# EasyEDA Pro project HF-RADIO.eprj

# Schematic radio-teste

## Sheets
1 SSB_GEN
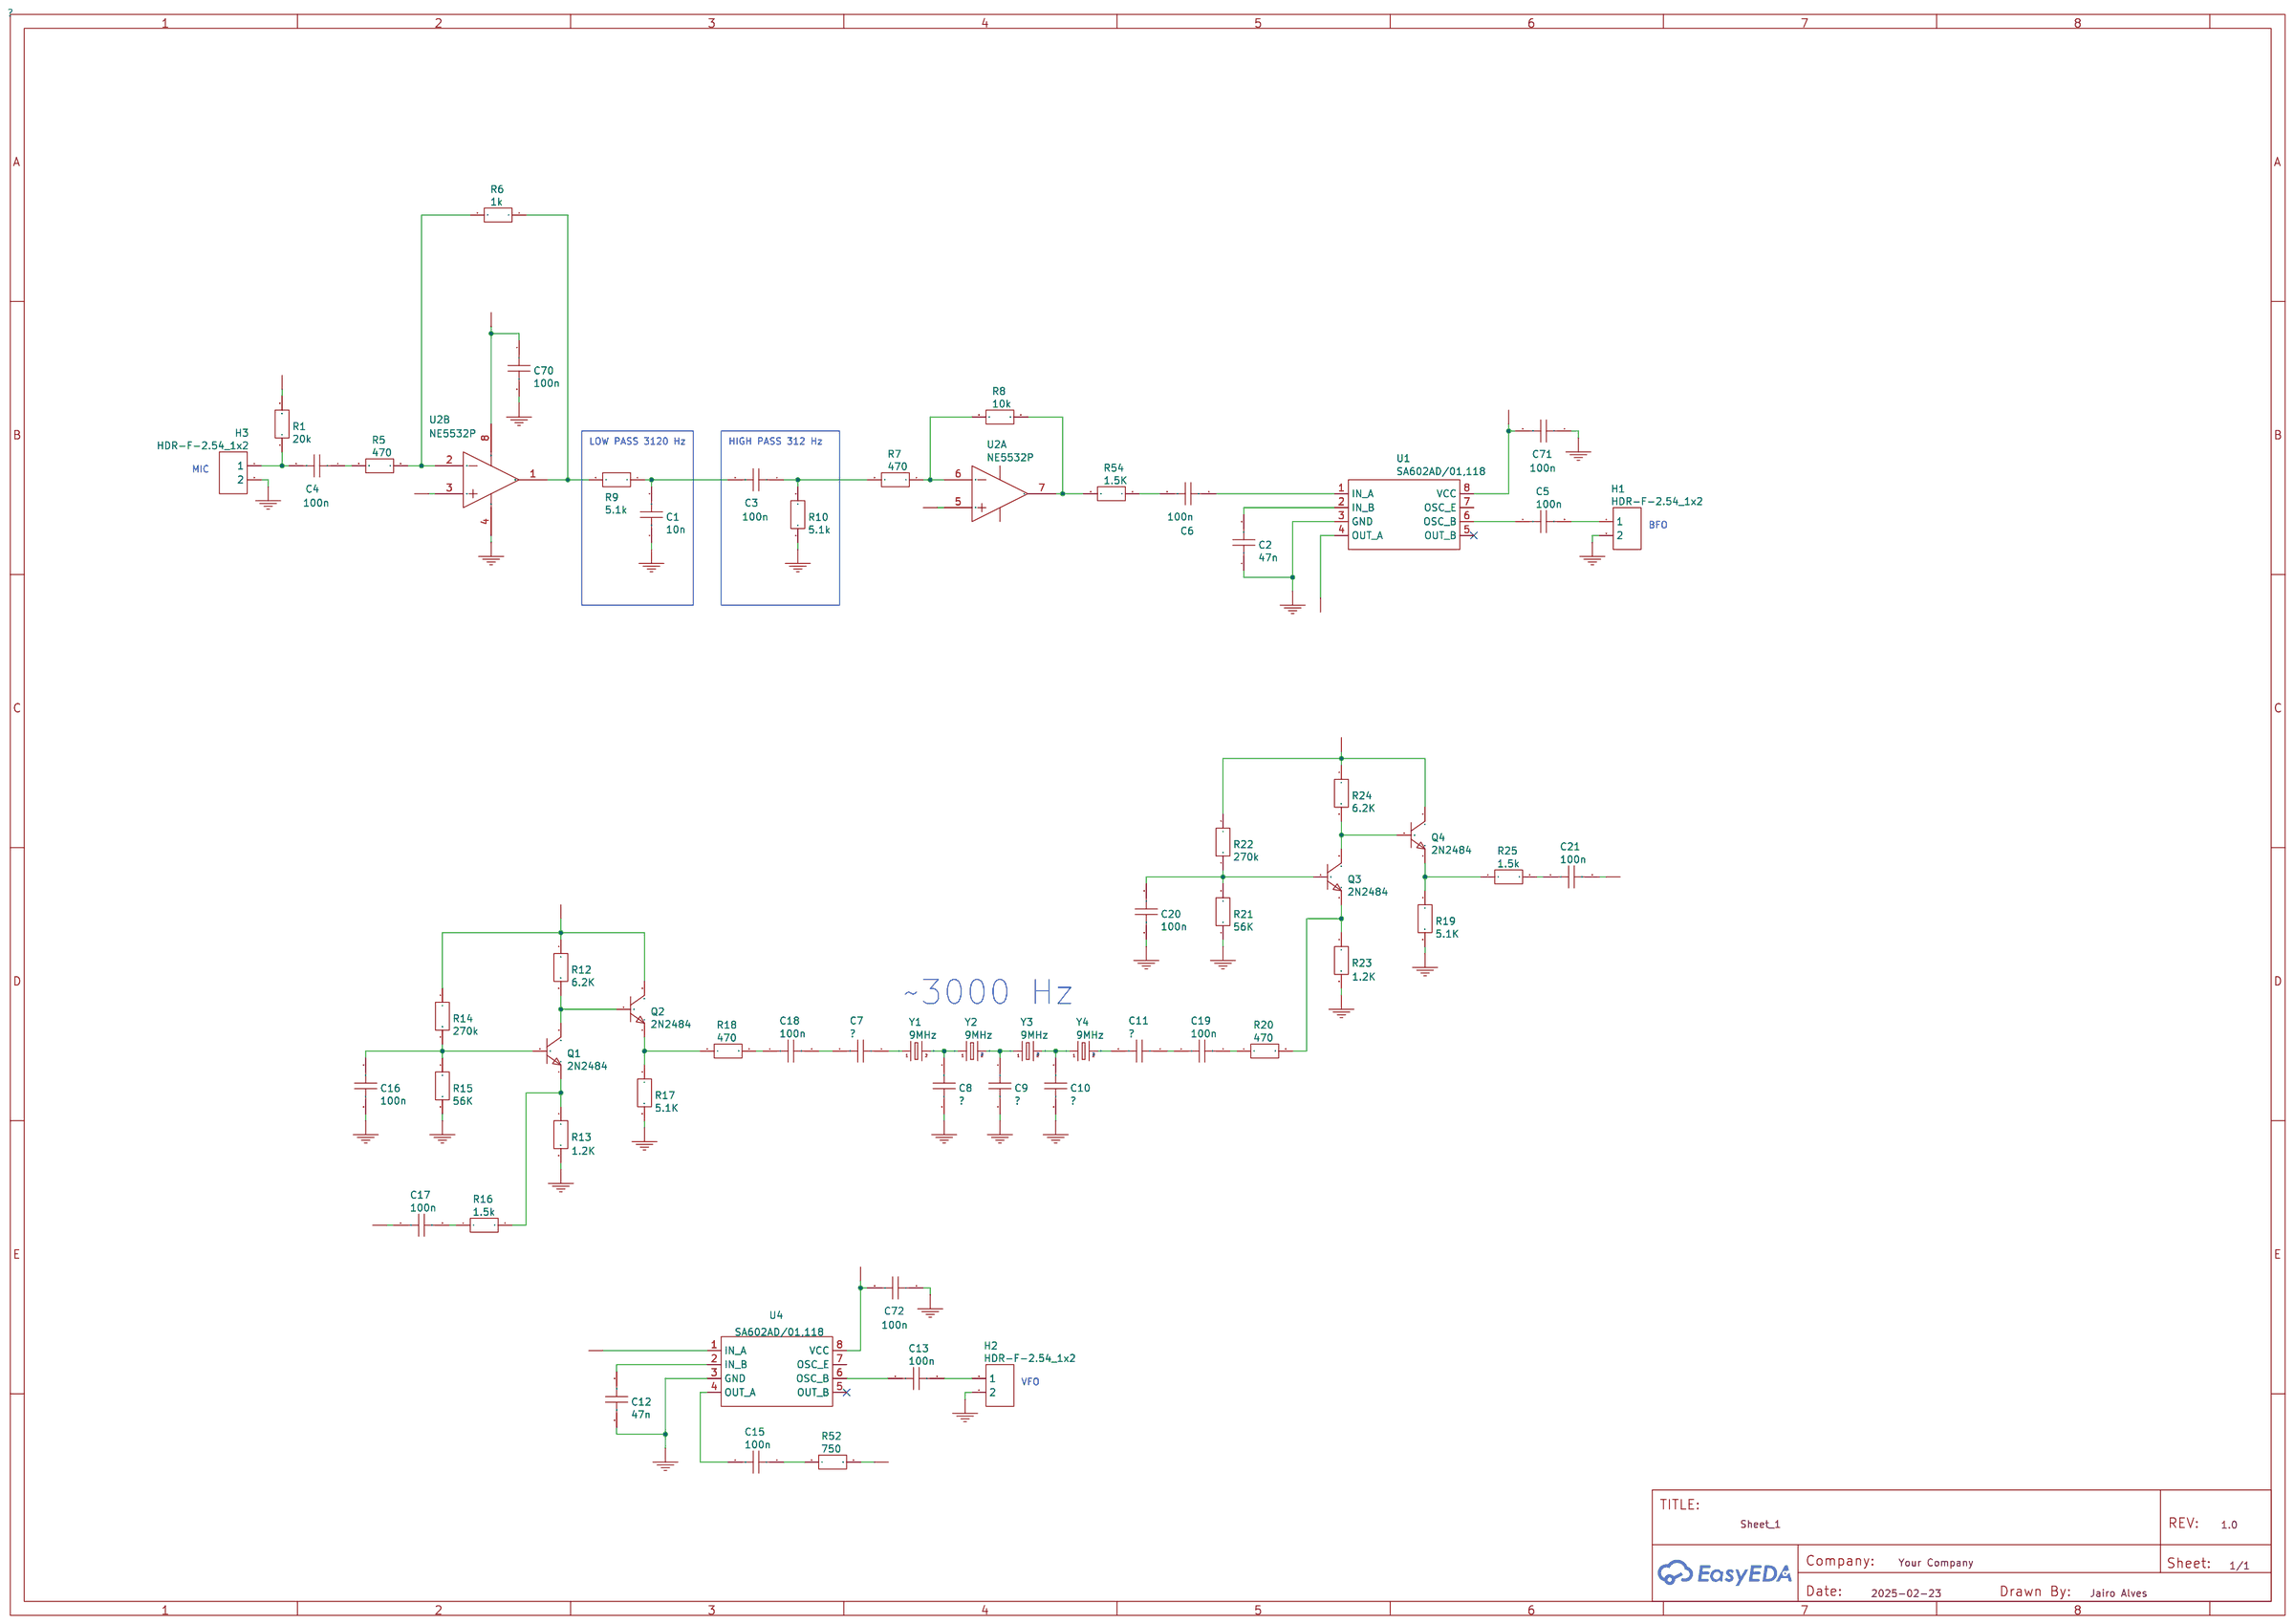
[diagram p0: SSB_GEN]
2 SSB_DEC: Board Name: SSB_MODULATION; Create Date: 2025-04-01; Page Name: SSB_DEC; Project Name: HF-RADIO; Schematic Name: radio-teste; Update Date: 2025-04-01; Add into BOM: yes; Company: Your Company; Convert to PCB: yes; Date: 2025-03-25; Draw By: Jairo Alves; REV: 1.0; Sheet: 1/1; spicePre: .
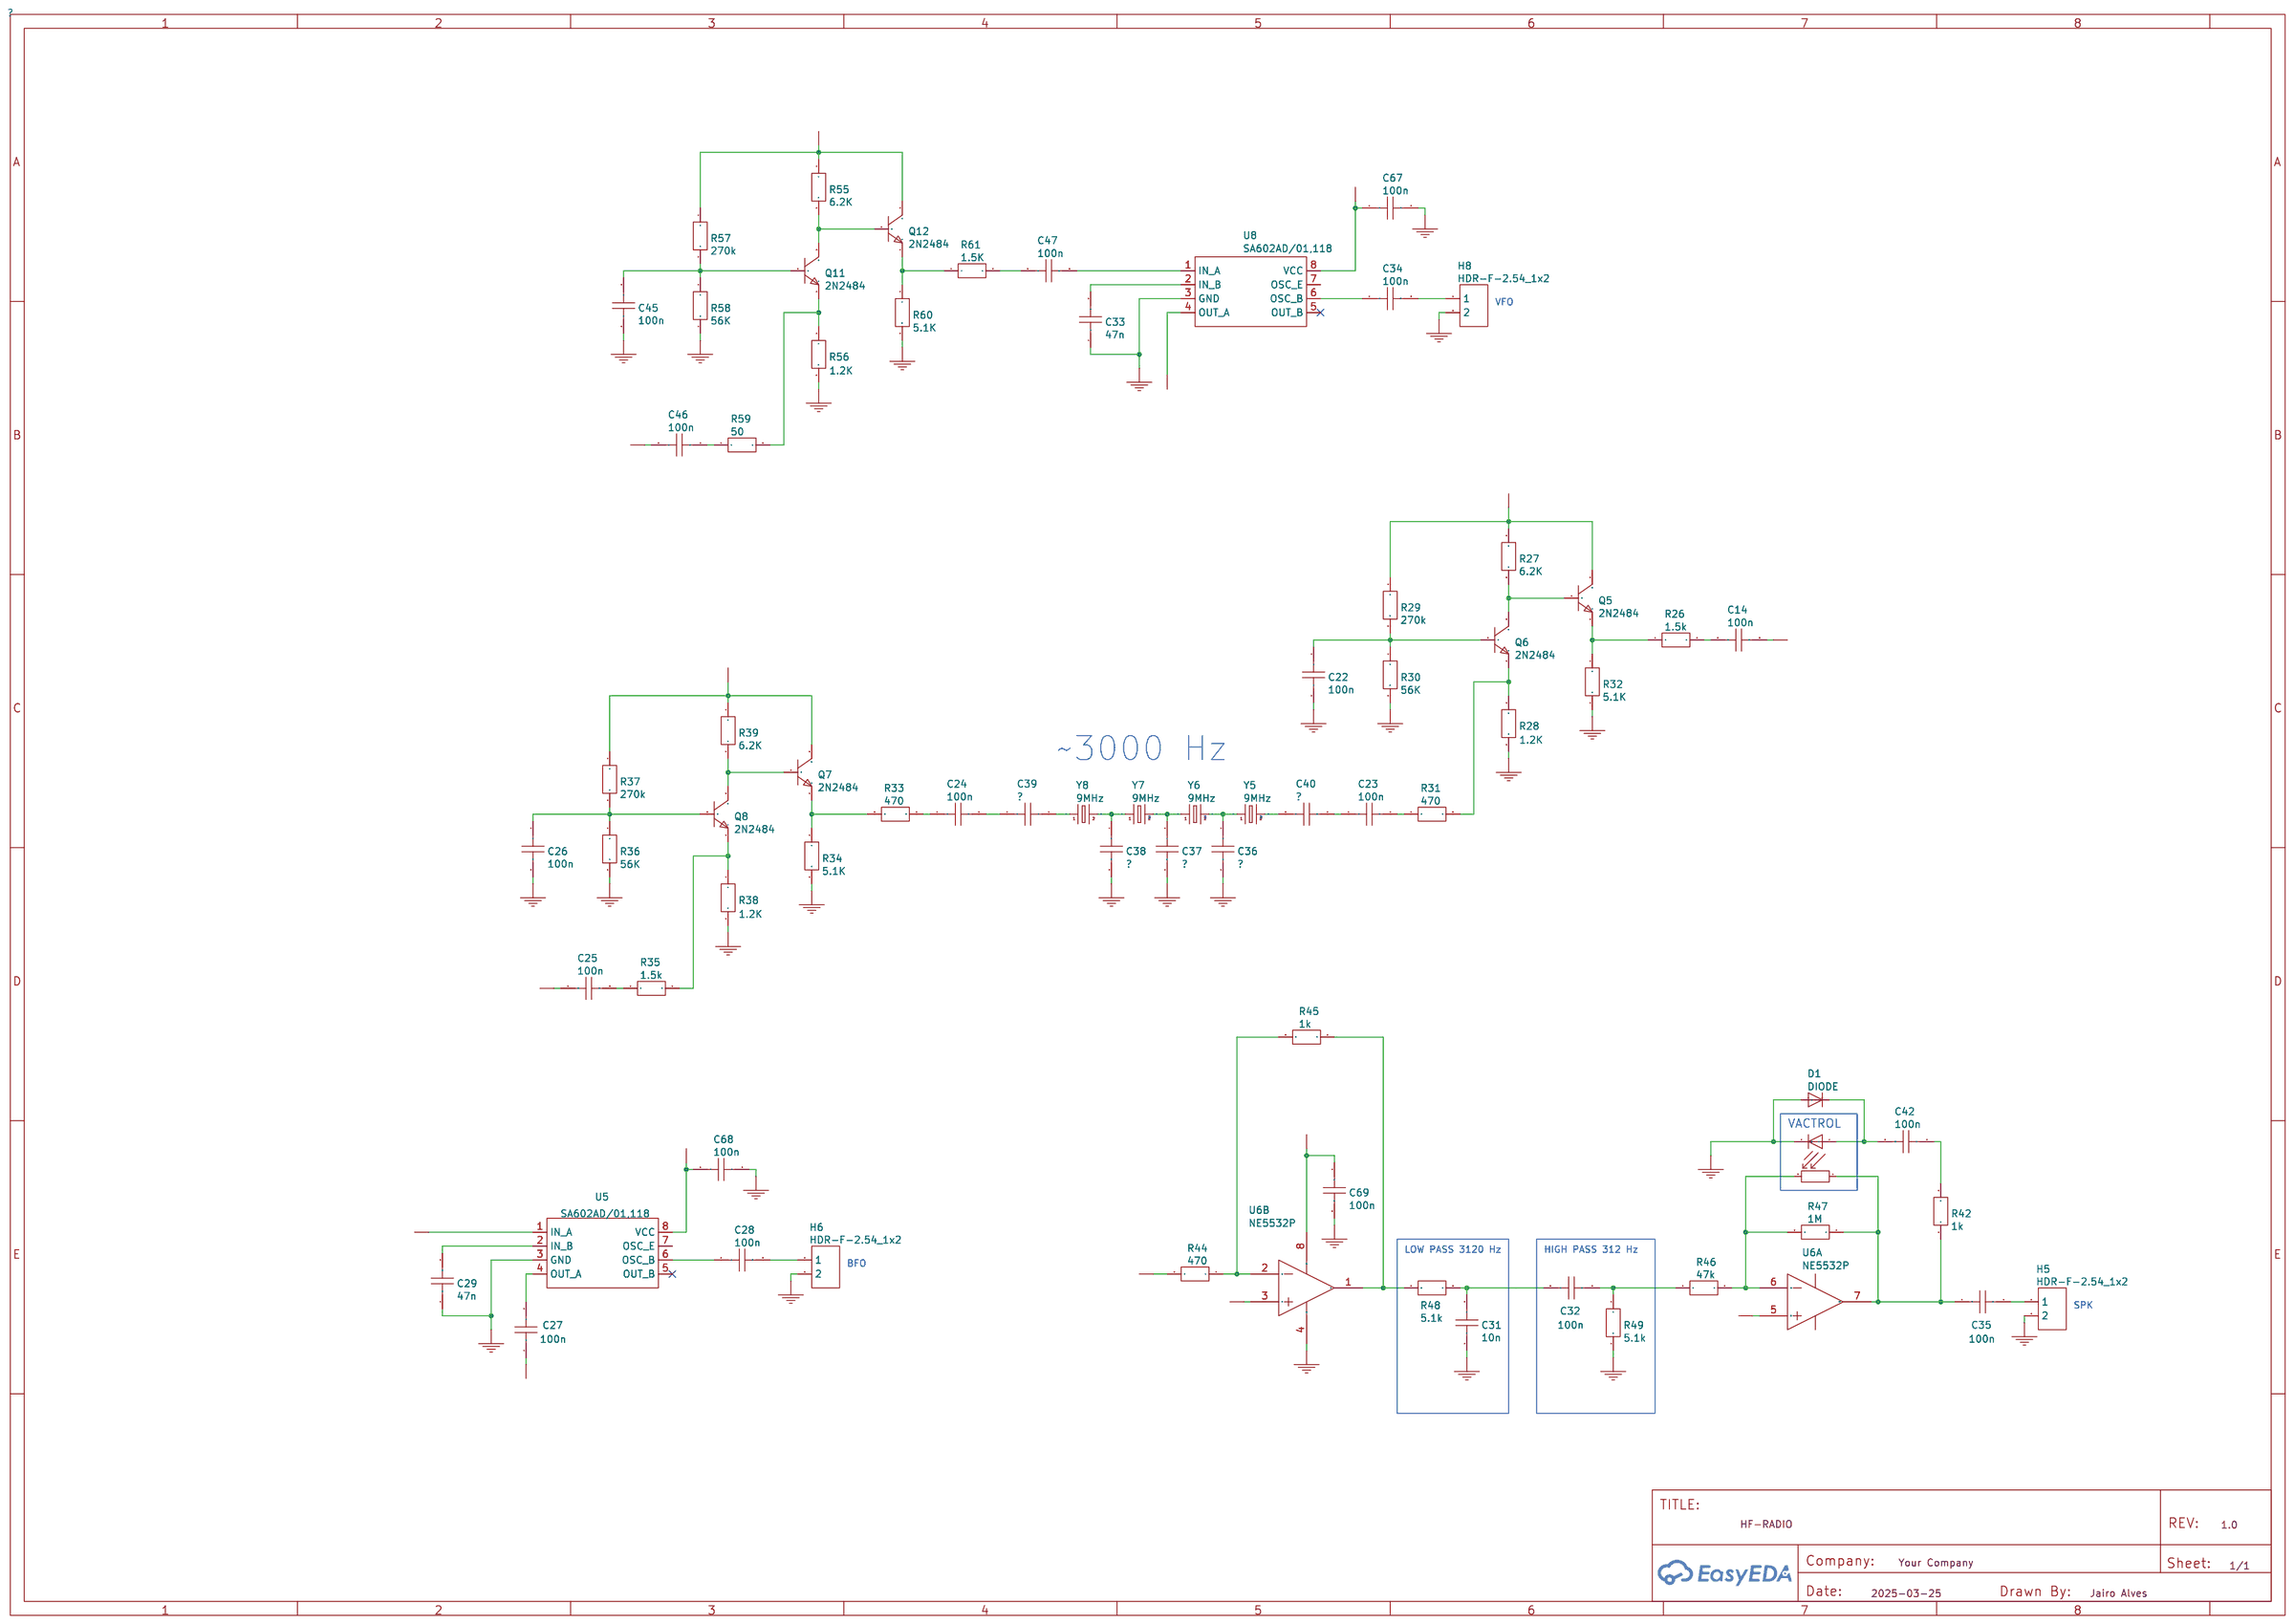
[diagram p1: SSB_DEC]

## Parts
sheet SSB_DEC
C14  100n  [RAD-0.1]
C22  100n  [RAD-0.1]
C23  100n  [RAD-0.1]
C24  100n  [RAD-0.1]
C25  100n  [RAD-0.1]
C26  100n  [RAD-0.1]
C27  100n  [RAD-0.1]
C28  100n  [RAD-0.1]
C29  47n  [RAD-0.1]
C31  10n  [RAD-0.1]
C32  100n  [RAD-0.1]
C33  47n  [RAD-0.1]
C34  100n  [RAD-0.1]
C35  100n  [RAD-0.1]
C36  ?  [RAD-0.1]
C37  ?  [RAD-0.1]
C38  ?  [RAD-0.1]
C39  ?  [RAD-0.1]
C40  ?  [RAD-0.1]
C42  100n  [RAD-0.1]
C45  100n  [RAD-0.1]
C46  100n  [RAD-0.1]
C47  100n  [RAD-0.1]
C67  100n  [RAD-0.1]
C68  100n  [RAD-0.1]
C69  100n  [RAD-0.1]
D1  DIODE
H5  HDR-F-2.54_1x2  [HDR-F-2.54_1X2]
H6  HDR-F-2.54_1x2  [HDR-F-2.54_1X2]
H8  HDR-F-2.54_1x2  [HDR-F-2.54_1X2]
LED1  LED5MM
Q5  2N2484
Q6  2N2484
Q7  2N2484
Q8  2N2484
Q11  2N2484
Q12  2N2484
R26  1.5k  [R_AXIAL-0.3]
R27  6.2K  [R_AXIAL-0.3]
R28  1.2K  [R_AXIAL-0.3]
R29  270k  [R_AXIAL-0.3]
R30  56K  [R_AXIAL-0.3]
R31  470  [R_AXIAL-0.3]
R32  5.1K  [R_AXIAL-0.3]
R33  470  [R_AXIAL-0.3]
R34  5.1K  [R_AXIAL-0.3]
R35  1.5k  [R_AXIAL-0.3]
R36  56K  [R_AXIAL-0.3]
R37  270k  [R_AXIAL-0.3]
R38  1.2K  [R_AXIAL-0.3]
R39  6.2K  [R_AXIAL-0.3]
R40  A9050
R42  1k  [R_AXIAL-0.3]
R44  470  [R_AXIAL-0.3]
R45  1k  [R_AXIAL-0.3]
R46  47k  [R_AXIAL-0.3]
R47  1M  [R_AXIAL-0.3]
R48  5.1k  [R_AXIAL-0.3]
R49  5.1k  [R_AXIAL-0.3]
R55  6.2K  [R_AXIAL-0.3]
R56  1.2K  [R_AXIAL-0.3]
R57  270k  [R_AXIAL-0.3]
R58  56K  [R_AXIAL-0.3]
R59  50  [R_AXIAL-0.3]
R60  5.1K  [R_AXIAL-0.3]
R61  1.5K  [R_AXIAL-0.3]
U5  SA602AD/01,118  [SOP-8_L4.9-W3.9-P1.27-LS6.0-BL]
U6  NE5532P  [DIP-8_L9.4-W6.4-P2.54-LS9.1-BL]  (sections 1,2)
U8  SA602AD/01,118  [SOP-8_L4.9-W3.9-P1.27-LS6.0-BL]
Y5  9MHz  [HC49U-V]
Y6  9MHz  [HC49U-V]
Y7  9MHz  [HC49U-V]
Y8  9MHz  [HC49U-V]
sheet SSB_GEN
C1  10n  [RAD-0.1]
C2  47n  [RAD-0.1]
C3  100n  [RAD-0.1]
C4  100n  [RAD-0.1]
C5  100n  [RAD-0.1]
C6  100n  [RAD-0.1]
C7  ?  [RAD-0.1]
C8  ?  [RAD-0.1]
C9  ?  [RAD-0.1]
C10  ?  [RAD-0.1]
C11  ?  [RAD-0.1]
C12  47n  [RAD-0.1]
C13  100n  [RAD-0.1]
C15  100n  [RAD-0.1]
C16  100n  [RAD-0.1]
C17  100n  [RAD-0.1]
C18  100n  [RAD-0.1]
C19  100n  [RAD-0.1]
C20  100n  [RAD-0.1]
C21  100n  [RAD-0.1]
C70  100n  [RAD-0.1]
C71  100n  [RAD-0.1]
C72  100n  [RAD-0.1]
H1  HDR-F-2.54_1x2  [HDR-F-2.54_1X2]
H2  HDR-F-2.54_1x2  [HDR-F-2.54_1X2]
H3  HDR-F-2.54_1x2  [HDR-F-2.54_1X2]
Q1  2N2484
Q2  2N2484
Q3  2N2484
Q4  2N2484
R1  20k  [R_AXIAL-0.3]
R5  470  [R_AXIAL-0.3]
R6  1k  [R_AXIAL-0.3]
R7  470  [R_AXIAL-0.3]
R8  10k  [R_AXIAL-0.3]
R9  5.1k  [R_AXIAL-0.3]
R10  5.1k  [R_AXIAL-0.3]
R12  6.2K  [R_AXIAL-0.3]
R13  1.2K  [R_AXIAL-0.3]
R14  270k  [R_AXIAL-0.3]
R15  56K  [R_AXIAL-0.3]
R16  1.5k  [R_AXIAL-0.3]
R17  5.1K  [R_AXIAL-0.3]
R18  470  [R_AXIAL-0.3]
R19  5.1K  [R_AXIAL-0.3]
R20  470  [R_AXIAL-0.3]
R21  56K  [R_AXIAL-0.3]
R22  270k  [R_AXIAL-0.3]
R23  1.2K  [R_AXIAL-0.3]
R24  6.2K  [R_AXIAL-0.3]
R25  1.5k  [R_AXIAL-0.3]
R52  750  [R_AXIAL-0.3]
R54  1.5K  [R_AXIAL-0.3]
U1  SA602AD/01,118  [SOP-8_L4.9-W3.9-P1.27-LS6.0-BL]
U2  NE5532P  [DIP-8_L9.4-W6.4-P2.54-LS9.1-BL]  (sections 1,2)
U4  SA602AD/01,118  [SOP-8_L4.9-W3.9-P1.27-LS6.0-BL]
Y1  9MHz  [HC49U-V]
Y2  9MHz  [HC49U-V]
Y3  9MHz  [HC49U-V]
Y4  9MHz  [HC49U-V]

## Library data of the parts
C3-C6 C13-C28 C32 C34 C35 C42 C45-C47 C67-C72 = 100n: nameAlias: Value(F); Contributor: LCEDA_Lib; spicePre: C; spiceSymbolName: C_RAD-0.1_US
C2 C12 C29 C33 = 47n: nameAlias: Value(F); Contributor: LCEDA_Lib; spicePre: C; spiceSymbolName: C_RAD-0.1_US
C1 C31 = 10n: nameAlias: Value(F); Contributor: LCEDA_Lib; spicePre: C; spiceSymbolName: C_RAD-0.1_US
C7-C11 C36-C40 = ?: nameAlias: Value(F); Contributor: LCEDA_Lib; spicePre: C; spiceSymbolName: C_RAD-0.1_US
D1 = DIODE: Contributor: Adafruit; spicePre: D
H1-H3 H5 H6 H8 = HDR-F-2.54_1x2: Supplier Part: C49661; Supplier: LCSC; Contributor: LCEDA_Lib; spicePre: H
LED1 = LED5MM: Contributor: Pinoccio; spicePre: L
Q1-Q8 Q11 Q12 = 2N2484: Supplier: LCSC; Supplier Part: C5444770; Manufacturer: MICROCHIP(美国微芯); Contributor: lcsc; spicePre: Q
R16 R25 R26 R35 = 1.5k: nameAlias: Value(Ω); Contributor: LCEDA_Lib; spicePre: R; spiceSymbolName: R_AXIAL-0.3_EU
R12 R24 R27 R39 R55 = 6.2K: nameAlias: Value(Ω); Contributor: LCEDA_Lib; spicePre: R; spiceSymbolName: R_AXIAL-0.3_EU
R13 R23 R28 R38 R56 = 1.2K: nameAlias: Value(Ω); Contributor: LCEDA_Lib; spicePre: R; spiceSymbolName: R_AXIAL-0.3_EU
R14 R22 R29 R37 R57 = 270k: nameAlias: Value(Ω); Contributor: LCEDA_Lib; spicePre: R; spiceSymbolName: R_AXIAL-0.3_EU
R15 R21 R30 R36 R58 = 56K: nameAlias: Value(Ω); Contributor: LCEDA_Lib; spicePre: R; spiceSymbolName: R_AXIAL-0.3_EU
R5 R7 R18 R20 R31 R33 R44 = 470: nameAlias: Value(Ω); Contributor: LCEDA_Lib; spicePre: R; spiceSymbolName: R_AXIAL-0.3_EU
R17 R19 R32 R34 R60 = 5.1K: nameAlias: Value(Ω); Contributor: LCEDA_Lib; spicePre: R; spiceSymbolName: R_AXIAL-0.3_EU
R40 = A9050: license: https://www.gnu.org/licenses/lgpl-2.1.html; Contributor: KiCAD; spicePre: R
R6 R42 R45 = 1k: nameAlias: Value(Ω); Contributor: LCEDA_Lib; spicePre: R; spiceSymbolName: R_AXIAL-0.3_EU
R46 = 47k: nameAlias: Value(Ω); Contributor: LCEDA_Lib; spicePre: R; spiceSymbolName: R_AXIAL-0.3_EU
R47 = 1M: nameAlias: Value(Ω); Contributor: LCEDA_Lib; spicePre: R; spiceSymbolName: R_AXIAL-0.3_EU
R9 R10 R48 R49 = 5.1k: nameAlias: Value(Ω); Contributor: LCEDA_Lib; spicePre: R; spiceSymbolName: R_AXIAL-0.3_EU
R59 = 50: nameAlias: Value(Ω); Contributor: LCEDA_Lib; spicePre: R; spiceSymbolName: R_AXIAL-0.3_EU
R54 R61 = 1.5K: nameAlias: Value(Ω); Contributor: LCEDA_Lib; spicePre: R; spiceSymbolName: R_AXIAL-0.3_EU
U1 U4 U5 U8 = SA602AD/01,118: Supplier: LCSC; Supplier Part: C2654478; Manufacturer: NXP(恩智浦); JLCPCB Part Class: Extended Part; Contributor: LCSC; spicePre: U
U2 U6 = NE5532P: tags: Audio Operational Amplifier; image: http://image.lceda.cn/szlcsc/C5326.jpg; Supplier Part: C5326; Supplier: LCSC; Manufacturer: TI(德州仪器); JLCPCB Part Class: Extended Part; timeStamp: 1460221582; subpart_no: 1; spicePre: U
Y1-Y8 = 9MHz: Contributor: SparkFun; spicePre: Y; spiceSymbolName: CRYSTALHC49UV
R1 = 20k: nameAlias: Value(Ω); Contributor: LCEDA_Lib; spicePre: R; spiceSymbolName: R_AXIAL-0.3_EU
R8 = 10k: nameAlias: Value(Ω); Contributor: LCEDA_Lib; spicePre: R; spiceSymbolName: R_AXIAL-0.3_EU
R52 = 750: nameAlias: Value(Ω); Contributor: LCEDA_Lib; spicePre: R; spiceSymbolName: R_AXIAL-0.3_EU

## Nets
GND: C1.1 C2.1 C8.2 C9.2 C10.2 C12.1 C16.2 C20.2 C22.2 C26.2 C29.1 C31.1 C33.1 C36.2 C37.2 C38.2 C45.2 C67.2 C68.2 C69.2 C70.2 C71.1 C72.1 D1.A H1.2 H2.2 H3.2 H5.2 H6.2 H8.2 LED1.K(C) R10.2 R13.2 R15.2 R17.2 R19.2 R21.2 R23.2 R28.2 R30.2 R32.2 R34.2 R36.2 R38.2 R49.2 R56.2 R58.2 R60.2 U1.3(GND) U2.4(VCC-) U4.3(GND) U5.3(GND) U6.4(VCC-) U8.3(GND)
AUD_FLT: C27.1 R44.2
CFRX_IN: C25.1 U8.4(OUT_A)
CFRX_OUT: C14.2 U5.1(IN_A)
CFTX_IN: C17.1 U1.4(OUT_A)
CFTX_OUT: C21.2 U4.1(IN_A)
SSB_IN: C46.1
SSB_OUT: R52.2
SSBMXR: C67.1 C68.1 C71.2 C72.2 U1.8(VCC) U4.8(VCC) U5.8(VCC) U8.8(VCC)
SSBPWR: C69.1 C70.1 Q2.3(C) Q4.3(C) Q5.3(C) Q7.3(C) Q12.3(C) R1.2 R12.1 R14.1 R22.1 R24.1 R27.1 R29.1 R37.1 R39.1 R55.1 R57.1 U2.8(VCC+) U6.8(VCC+)
VCC/2: U2.3(IN1+) U2.5(IN2+) U6.3(IN1+) U6.5(IN2+)
Net-(C1-2): C1.2 C3.2 R9.1
Net-(C2-2): C2.2 U1.2(IN_B)
Net-(C3-1): C3.1 R7.2 R10.1
Net-(C4-1): C4.1 R5.2
Net-(C4-2): C4.2 H3.1 R1.1
Net-(C5-1): C5.1 U1.6(OSC_B)
Net-(C5-2): C5.2 H1.1
Net-(C6-1): C6.1 U1.1(IN_A)
Net-(C6-2): C6.2 R54.1
Net-(C7-1): C7.1 Y1.1
Net-(C7-2): C7.2 C18.2
Net-(C8-1): C8.1 Y1.2 Y2.1
Net-(C9-1): C9.1 Y2.2 Y3.1
Net-(C10-1): C10.1 Y3.2 Y4.1
Net-(C11-1): C11.1 C19.1
Net-(C11-2): C11.2 Y4.2
Net-(C12-2): C12.2 U4.2(IN_B)
Net-(C13-1): C13.1 U4.6(OSC_B)
Net-(C13-2): C13.2 H2.1
Net-(C14-1): C14.1 R26.2
Net-(C15-1): C15.1 R52.1
Net-(C15-2): C15.2 U4.4(OUT_A)
Net-(C16-1): C16.1 Q1.2(B) R14.2 R15.1
Net-(C17-2): C17.2 R16.1
Net-(C18-1): C18.1 R18.2
Net-(C19-2): C19.2 R20.1
Net-(C20-1): C20.1 Q3.2(B) R21.1 R22.2
Net-(C21-1): C21.1 R25.2
Net-(C22-1): C22.1 Q6.2(B) R29.2 R30.1
Net-(C23-1): C23.1 C40.1
Net-(C23-2): C23.2 R31.1
Net-(C24-1): C24.1 R33.2
Net-(C24-2): C24.2 C39.2
Net-(C25-2): C25.2 R35.1
Net-(C26-1): C26.1 Q8.2(B) R36.1 R37.2
Net-(C27-2): C27.2 U5.4(OUT_A)
Net-(C28-1): C28.1 U5.6(OSC_B)
Net-(C28-2): C28.2 H6.1
Net-(C29-2): C29.2 U5.2(IN_B)
Net-(C31-2): C31.2 C32.2 R48.1
Net-(C32-1): C32.1 R46.2 R49.1
Net-(C33-2): C33.2 U8.2(IN_B)
Net-(C34-1): C34.1 U8.6(OSC_B)
Net-(C34-2): C34.2 H8.1
Net-(C35-1): C35.1 H5.1
Net-(C35-2): C35.2 R40.1 R42.1 R47.1 U6.7(OUT2)
Net-(C36-1): C36.1 Y5.1 Y6.2
Net-(C37-1): C37.1 Y6.1 Y7.2
Net-(C38-1): C38.1 Y7.1 Y8.2
Net-(C39-1): C39.1 Y8.1
Net-(C40-2): C40.2 Y5.2
Net-(C42-1): C42.1 R42.2
Net-(C42-2): C42.2 D1.C LED1.A
Net-(C45-1): C45.1 Q11.2(B) R57.2 R58.1
Net-(C46-2): C46.2 R59.1
Net-(C47-1): C47.1 R61.2
Net-(C47-2): C47.2 U8.1(IN_A)
Net-(Q1-1): Q1.1(E) R13.1 R16.2
Net-(Q1-3): Q1.3(C) Q2.2(B) R12.2
Net-(Q2-1): Q2.1(E) R17.1 R18.1
Net-(Q3-1): Q3.1(E) R20.2 R23.1
Net-(Q3-3): Q3.3(C) Q4.2(B) R24.2
Net-(Q4-1): Q4.1(E) R19.1 R25.1
Net-(Q5-1): Q5.1(E) R26.1 R32.1
Net-(Q5-2): Q5.2(B) Q6.3(C) R27.2
Net-(Q6-1): Q6.1(E) R28.1 R31.2
Net-(Q7-1): Q7.1(E) R33.1 R34.1
Net-(Q7-2): Q7.2(B) Q8.3(C) R39.2
Net-(Q8-1): Q8.1(E) R35.2 R38.1
Net-(Q11-1): Q11.1(E) R56.1 R59.2
Net-(Q11-3): Q11.3(C) Q12.2(B) R55.2
Net-(Q12-1): Q12.1(E) R60.1 R61.1
Net-(R5-1): R5.1 R6.2 U2.2(IN1-)
Net-(R6-1): R6.1 R9.2 U2.1(OUT1)
Net-(R7-1): R7.1 R8.2 U2.6(IN2-)
Net-(R8-1): R8.1 R54.2 U2.7(OUT2)
Net-(R40-2): R40.2 R46.1 R47.2 U6.6(IN2-)
Net-(R44-1): R44.1 R45.2 U6.2(IN1-)
Net-(R45-1): R45.1 R48.2 U6.1(OUT1)

Not connected (* = marked no-connect by the designer): U1 5(OUT_B)* 7(OSC_E); U4 5(OUT_B)* 7(OSC_E); U5 5(OUT_B)* 7(OSC_E); U8 5(OUT_B)* 7(OSC_E)

## Notes on the sheets
sheet 1
- LOW PASS 3120 Hz
- HIGH PASS 312 Hz
- MIC
- BFO
- ~3000 Hz
- 2
- 2
- 2
- VFO
sheet 2
- VFO
- ~3000 Hz
- 2
- 2
- 2
- VACTROL
- LOW PASS 3120 Hz
- HIGH PASS 312 Hz
- BFO
- SPK

# Schematic Schematic1

## Sheets
1 CW_GEN: Board Name: CW_MODULATION; Create Date: 2025-04-01; Page Name: CW_GEN; Project Name: HF-RADIO; Schematic Name: Schematic1; Update Date: 2025-04-01; Company: EasyEDA.com; Page Size: A3; Version: V1.0
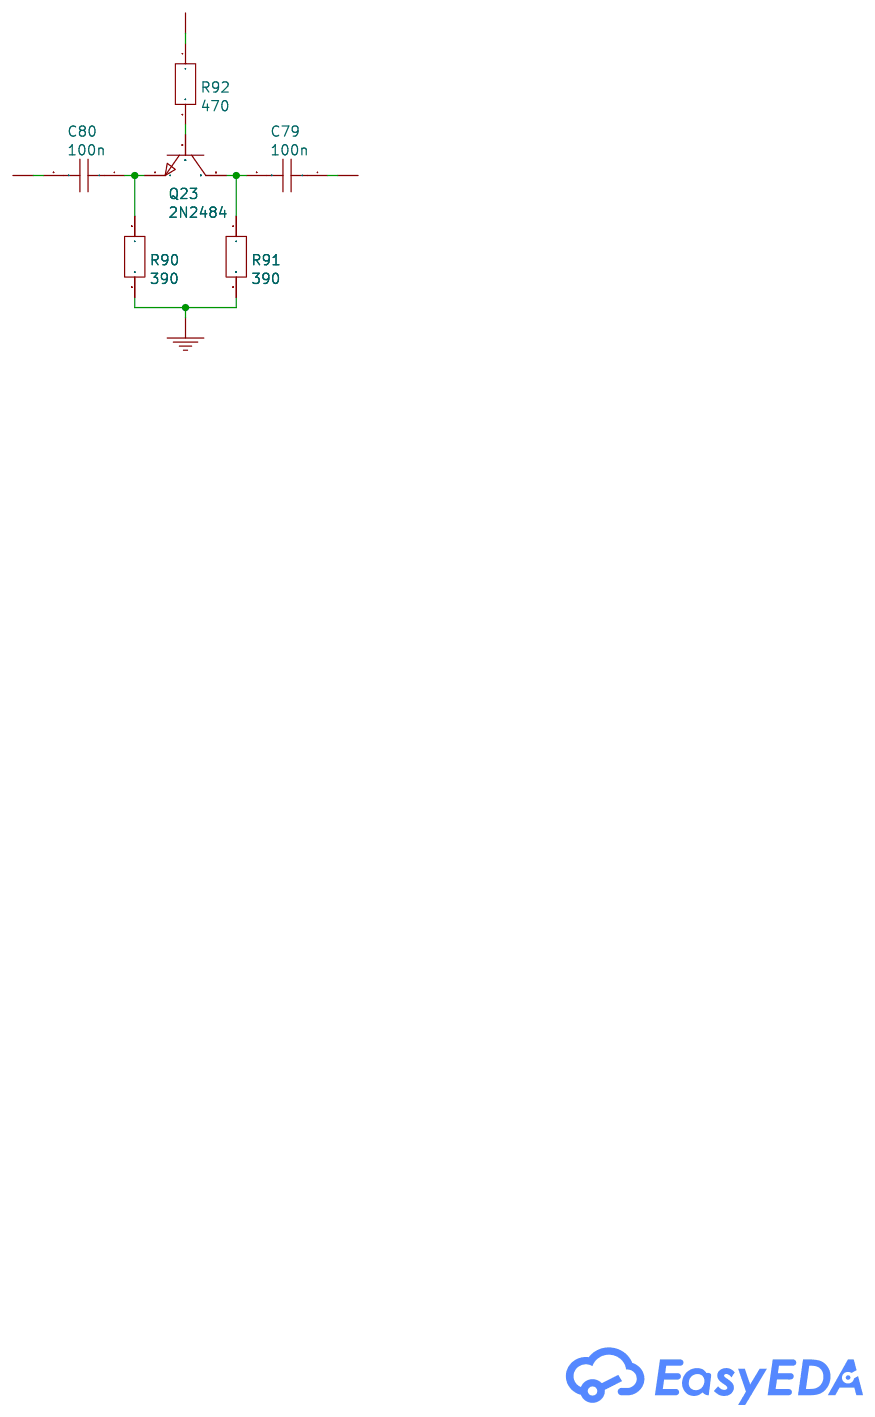
[diagram p2: CW_GEN]
2 CW_DEC
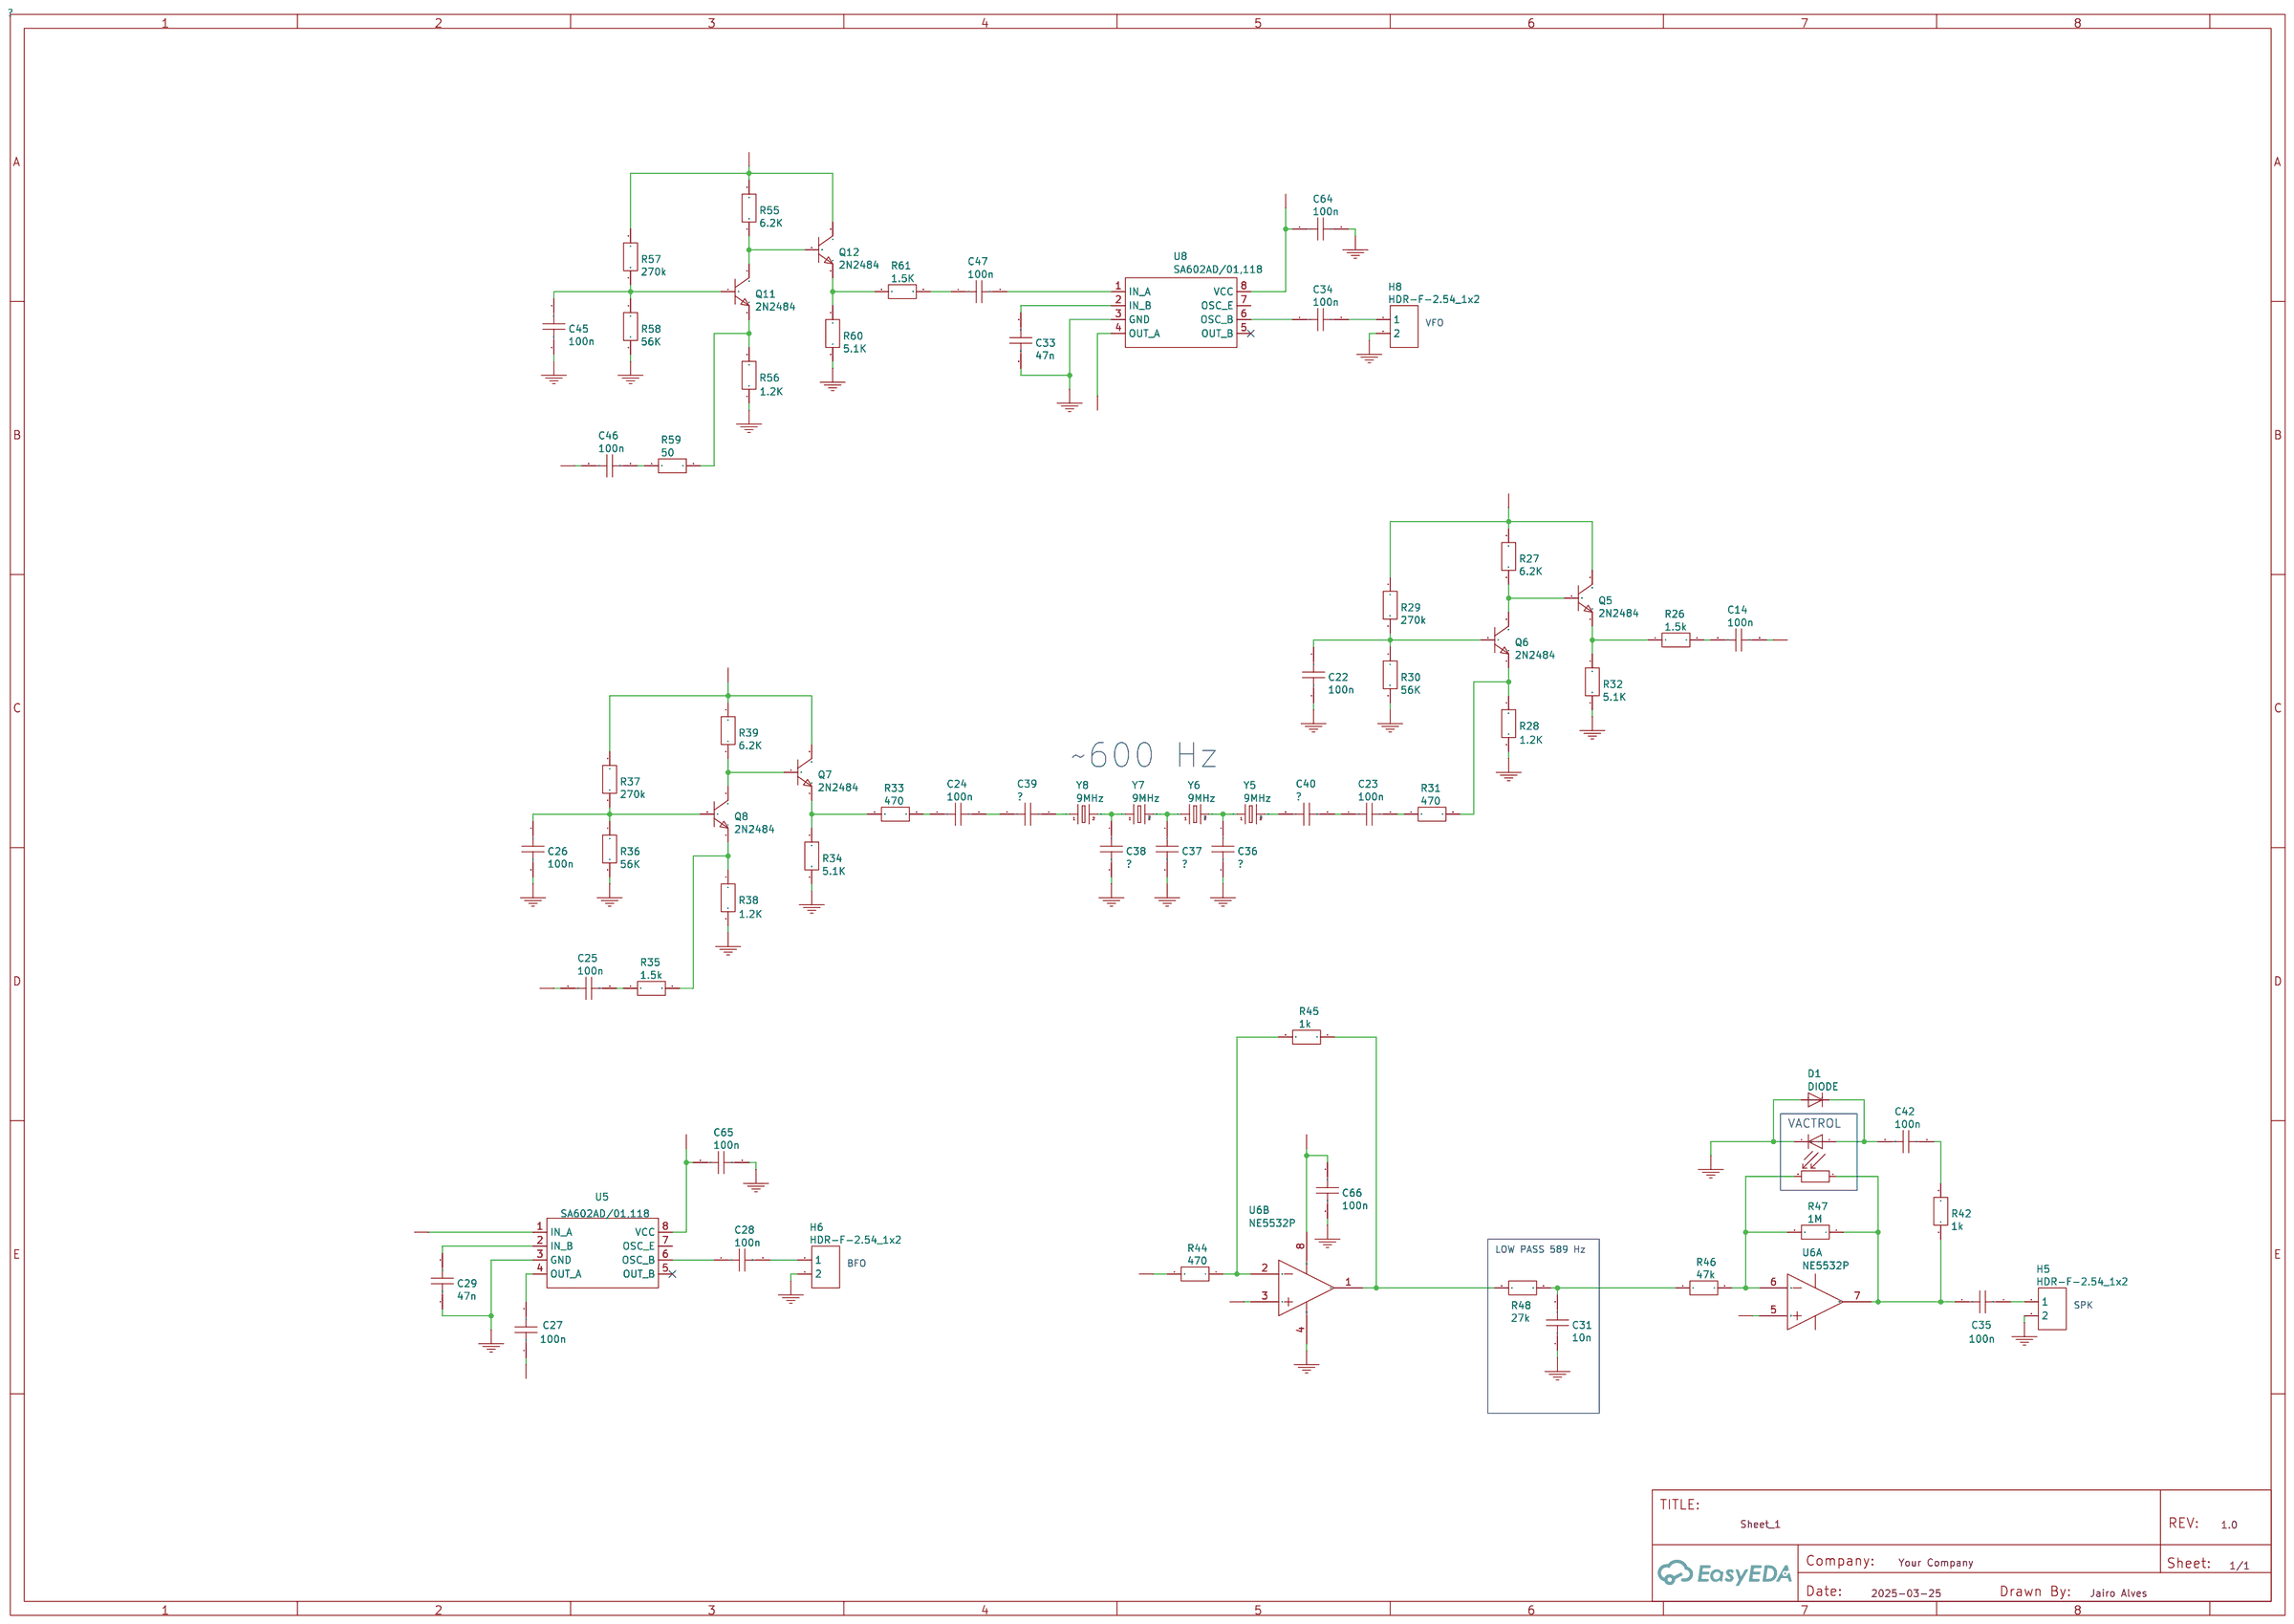
[diagram p3: CW_DEC]

## Parts
sheet CW_DEC
C14  100n  [RAD-0.1]
C22  100n  [RAD-0.1]
C23  100n  [RAD-0.1]
C24  100n  [RAD-0.1]
C25  100n  [RAD-0.1]
C26  100n  [RAD-0.1]
C27  100n  [RAD-0.1]
C28  100n  [RAD-0.1]
C29  47n  [RAD-0.1]
C31  10n  [RAD-0.1]
C33  47n  [RAD-0.1]
C34  100n  [RAD-0.1]
C35  100n  [RAD-0.1]
C36  ?  [RAD-0.1]
C37  ?  [RAD-0.1]
C38  ?  [RAD-0.1]
C39  ?  [RAD-0.1]
C40  ?  [RAD-0.1]
C42  100n  [RAD-0.1]
C45  100n  [RAD-0.1]
C46  100n  [RAD-0.1]
C47  100n  [RAD-0.1]
C64  100n  [RAD-0.1]
C65  100n  [RAD-0.1]
C66  100n  [RAD-0.1]
D1  DIODE
H5  HDR-F-2.54_1x2  [HDR-F-2.54_1X2]
H6  HDR-F-2.54_1x2  [HDR-F-2.54_1X2]
H8  HDR-F-2.54_1x2  [HDR-F-2.54_1X2]
LED1  LED5MM
Q5  2N2484
Q6  2N2484
Q7  2N2484
Q8  2N2484
Q11  2N2484
Q12  2N2484
R26  1.5k  [R_AXIAL-0.3]
R27  6.2K  [R_AXIAL-0.3]
R28  1.2K  [R_AXIAL-0.3]
R29  270k  [R_AXIAL-0.3]
R30  56K  [R_AXIAL-0.3]
R31  470  [R_AXIAL-0.3]
R32  5.1K  [R_AXIAL-0.3]
R33  470  [R_AXIAL-0.3]
R34  5.1K  [R_AXIAL-0.3]
R35  1.5k  [R_AXIAL-0.3]
R36  56K  [R_AXIAL-0.3]
R37  270k  [R_AXIAL-0.3]
R38  1.2K  [R_AXIAL-0.3]
R39  6.2K  [R_AXIAL-0.3]
R40  A9050
R42  1k  [R_AXIAL-0.3]
R44  470  [R_AXIAL-0.3]
R45  1k  [R_AXIAL-0.3]
R46  47k  [R_AXIAL-0.3]
R47  1M  [R_AXIAL-0.3]
R48  27k  [R_AXIAL-0.3]
R55  6.2K  [R_AXIAL-0.3]
R56  1.2K  [R_AXIAL-0.3]
R57  270k  [R_AXIAL-0.3]
R58  56K  [R_AXIAL-0.3]
R59  50  [R_AXIAL-0.3]
R60  5.1K  [R_AXIAL-0.3]
R61  1.5K  [R_AXIAL-0.3]
U5  SA602AD/01,118  [SOP-8_L4.9-W3.9-P1.27-LS6.0-BL]
U6  NE5532P  [DIP-8_L9.4-W6.4-P2.54-LS9.1-BL]  (sections 1,2)
U8  SA602AD/01,118  [SOP-8_L4.9-W3.9-P1.27-LS6.0-BL]
Y5  9MHz  [HC49U-V]
Y6  9MHz  [HC49U-V]
Y7  9MHz  [HC49U-V]
Y8  9MHz  [HC49U-V]
sheet CW_GEN
C79  100n  [RAD-0.1]
C80  100n  [RAD-0.1]
Q23  2N2484
R90  390  [R_AXIAL-0.3]
R91  390  [R_AXIAL-0.3]
R92  470  [R_AXIAL-0.3]

## Library data of the parts
C14 C22-C28 C34 C35 C42 C45-C47 C64-C66 C79 C80 = 100n: nameAlias: Value(F); Contributor: LCEDA_Lib; spicePre: C; spiceSymbolName: C_RAD-0.1_US
C29 C33 = 47n: nameAlias: Value(F); Contributor: LCEDA_Lib; spicePre: C; spiceSymbolName: C_RAD-0.1_US
C31 = 10n: nameAlias: Value(F); Contributor: LCEDA_Lib; spicePre: C; spiceSymbolName: C_RAD-0.1_US
C36-C40 = ?: nameAlias: Value(F); Contributor: LCEDA_Lib; spicePre: C; spiceSymbolName: C_RAD-0.1_US
D1 = DIODE: Contributor: Adafruit; spicePre: D
H5 H6 H8 = HDR-F-2.54_1x2: Supplier Part: C49661; Supplier: LCSC; Contributor: LCEDA_Lib; spicePre: H
LED1 = LED5MM: Contributor: Pinoccio; spicePre: L
Q5-Q8 Q11 Q12 Q23 = 2N2484: Supplier: LCSC; Supplier Part: C5444770; Manufacturer: MICROCHIP(美国微芯); Contributor: lcsc; spicePre: Q
R26 R35 = 1.5k: nameAlias: Value(Ω); Contributor: LCEDA_Lib; spicePre: R; spiceSymbolName: R_AXIAL-0.3_EU
R27 R39 R55 = 6.2K: nameAlias: Value(Ω); Contributor: LCEDA_Lib; spicePre: R; spiceSymbolName: R_AXIAL-0.3_EU
R28 R38 R56 = 1.2K: nameAlias: Value(Ω); Contributor: LCEDA_Lib; spicePre: R; spiceSymbolName: R_AXIAL-0.3_EU
R29 R37 R57 = 270k: nameAlias: Value(Ω); Contributor: LCEDA_Lib; spicePre: R; spiceSymbolName: R_AXIAL-0.3_EU
R30 R36 R58 = 56K: nameAlias: Value(Ω); Contributor: LCEDA_Lib; spicePre: R; spiceSymbolName: R_AXIAL-0.3_EU
R31 R33 R44 R92 = 470: nameAlias: Value(Ω); Contributor: LCEDA_Lib; spicePre: R; spiceSymbolName: R_AXIAL-0.3_EU
R32 R34 R60 = 5.1K: nameAlias: Value(Ω); Contributor: LCEDA_Lib; spicePre: R; spiceSymbolName: R_AXIAL-0.3_EU
R40 = A9050: license: https://www.gnu.org/licenses/lgpl-2.1.html; Contributor: KiCAD; spicePre: R
R42 R45 = 1k: nameAlias: Value(Ω); Contributor: LCEDA_Lib; spicePre: R; spiceSymbolName: R_AXIAL-0.3_EU
R46 = 47k: nameAlias: Value(Ω); Contributor: LCEDA_Lib; spicePre: R; spiceSymbolName: R_AXIAL-0.3_EU
R47 = 1M: nameAlias: Value(Ω); Contributor: LCEDA_Lib; spicePre: R; spiceSymbolName: R_AXIAL-0.3_EU
R48 = 27k: nameAlias: Value(Ω); Contributor: LCEDA_Lib; spicePre: R; spiceSymbolName: R_AXIAL-0.3_EU
R59 = 50: nameAlias: Value(Ω); Contributor: LCEDA_Lib; spicePre: R; spiceSymbolName: R_AXIAL-0.3_EU
R61 = 1.5K: nameAlias: Value(Ω); Contributor: LCEDA_Lib; spicePre: R; spiceSymbolName: R_AXIAL-0.3_EU
U5 U8 = SA602AD/01,118: Supplier: LCSC; Supplier Part: C2654478; Manufacturer: NXP(恩智浦); JLCPCB Part Class: Extended Part; Contributor: LCSC; spicePre: U
U6 = NE5532P: tags: Audio Operational Amplifier; image: http://image.lceda.cn/szlcsc/C5326.jpg; Supplier Part: C5326; Supplier: LCSC; Manufacturer: TI(德州仪器); JLCPCB Part Class: Extended Part; timeStamp: 1460221582; subpart_no: 1; spicePre: U
Y5-Y8 = 9MHz: Contributor: SparkFun; spicePre: Y; spiceSymbolName: CRYSTALHC49UV
R90 R91 = 390: nameAlias: Value(Ω); Contributor: LCEDA_Lib; spicePre: R; spiceSymbolName: R_AXIAL-0.3_EU

## Nets
GND: C22.2 C26.2 C29.1 C31.1 C33.1 C36.2 C37.2 C38.2 C45.2 C64.2 C65.2 C66.1 D1.A H5.2 H6.2 H8.2 LED1.K(C) R28.2 R30.2 R32.2 R34.2 R36.2 R38.2 R56.2 R58.2 R60.2 R90.2 R91.2 U5.3(GND) U6.4(VCC-) U8.3(GND)
CW_AUD_FLT: C27.1 R44.2
CW_CARRIER: C80.2
CW_IN: C46.1
CW_OUT: C79.1
CW_STATE: R92.1
CWFIN: C25.1 U8.4(OUT_A)
CWFOUT: C14.2 U5.1(IN_A)
CWMXR: C64.1 C65.1 U5.8(VCC) U8.8(VCC)
CWPWR: C66.2 Q5.3(C) Q7.3(C) Q12.3(C) R27.1 R29.1 R37.1 R39.1 R55.1 R57.1 U6.8(VCC+)
VCC/2: U6.3(IN1+) U6.5(IN2+)
Net-(C14-1): C14.1 R26.2
Net-(C22-1): C22.1 Q6.2(B) R29.2 R30.1
Net-(C23-1): C23.1 C40.1
Net-(C23-2): C23.2 R31.1
Net-(C24-1): C24.1 R33.2
Net-(C24-2): C24.2 C39.2
Net-(C25-2): C25.2 R35.1
Net-(C26-1): C26.1 Q8.2(B) R36.1 R37.2
Net-(C27-2): C27.2 U5.4(OUT_A)
Net-(C28-1): C28.1 U5.6(OSC_B)
Net-(C28-2): C28.2 H6.1
Net-(C29-2): C29.2 U5.2(IN_B)
Net-(C31-2): C31.2 R46.2 R48.1
Net-(C33-2): C33.2 U8.2(IN_B)
Net-(C34-1): C34.1 U8.6(OSC_B)
Net-(C34-2): C34.2 H8.1
Net-(C35-1): C35.1 H5.1
Net-(C35-2): C35.2 R40.1 R42.1 R47.1 U6.7(OUT2)
Net-(C36-1): C36.1 Y5.1 Y6.2
Net-(C37-1): C37.1 Y6.1 Y7.2
Net-(C38-1): C38.1 Y7.1 Y8.2
Net-(C39-1): C39.1 Y8.1
Net-(C40-2): C40.2 Y5.2
Net-(C42-1): C42.1 R42.2
Net-(C42-2): C42.2 D1.C LED1.A
Net-(C45-1): C45.1 Q11.2(B) R57.2 R58.1
Net-(C46-2): C46.2 R59.1
Net-(C47-1): C47.1 R61.2
Net-(C47-2): C47.2 U8.1(IN_A)
Net-(C79-2): C79.2 Q23.3(C) R91.1
Net-(C80-1): C80.1 Q23.1(E) R90.1
Net-(Q5-1): Q5.1(E) R26.1 R32.1
Net-(Q5-2): Q5.2(B) Q6.3(C) R27.2
Net-(Q6-1): Q6.1(E) R28.1 R31.2
Net-(Q7-1): Q7.1(E) R33.1 R34.1
Net-(Q7-2): Q7.2(B) Q8.3(C) R39.2
Net-(Q8-1): Q8.1(E) R35.2 R38.1
Net-(Q11-1): Q11.1(E) R56.1 R59.2
Net-(Q11-3): Q11.3(C) Q12.2(B) R55.2
Net-(Q12-1): Q12.1(E) R60.1 R61.1
Net-(Q23-2): Q23.2(B) R92.2
Net-(R40-2): R40.2 R46.1 R47.2 U6.6(IN2-)
Net-(R44-1): R44.1 R45.2 U6.2(IN1-)
Net-(R45-1): R45.1 R48.2 U6.1(OUT1)

Not connected (* = marked no-connect by the designer): U5 5(OUT_B)* 7(OSC_E); U8 5(OUT_B)* 7(OSC_E)

## Notes on the sheets
sheet 2
- VFO
- ~600 Hz
- 2
- 2
- 2
- VACTROL
- LOW PASS 589 Hz
- BFO
- SPK

# Schematic Schematic2

## Sheets
1 POWER
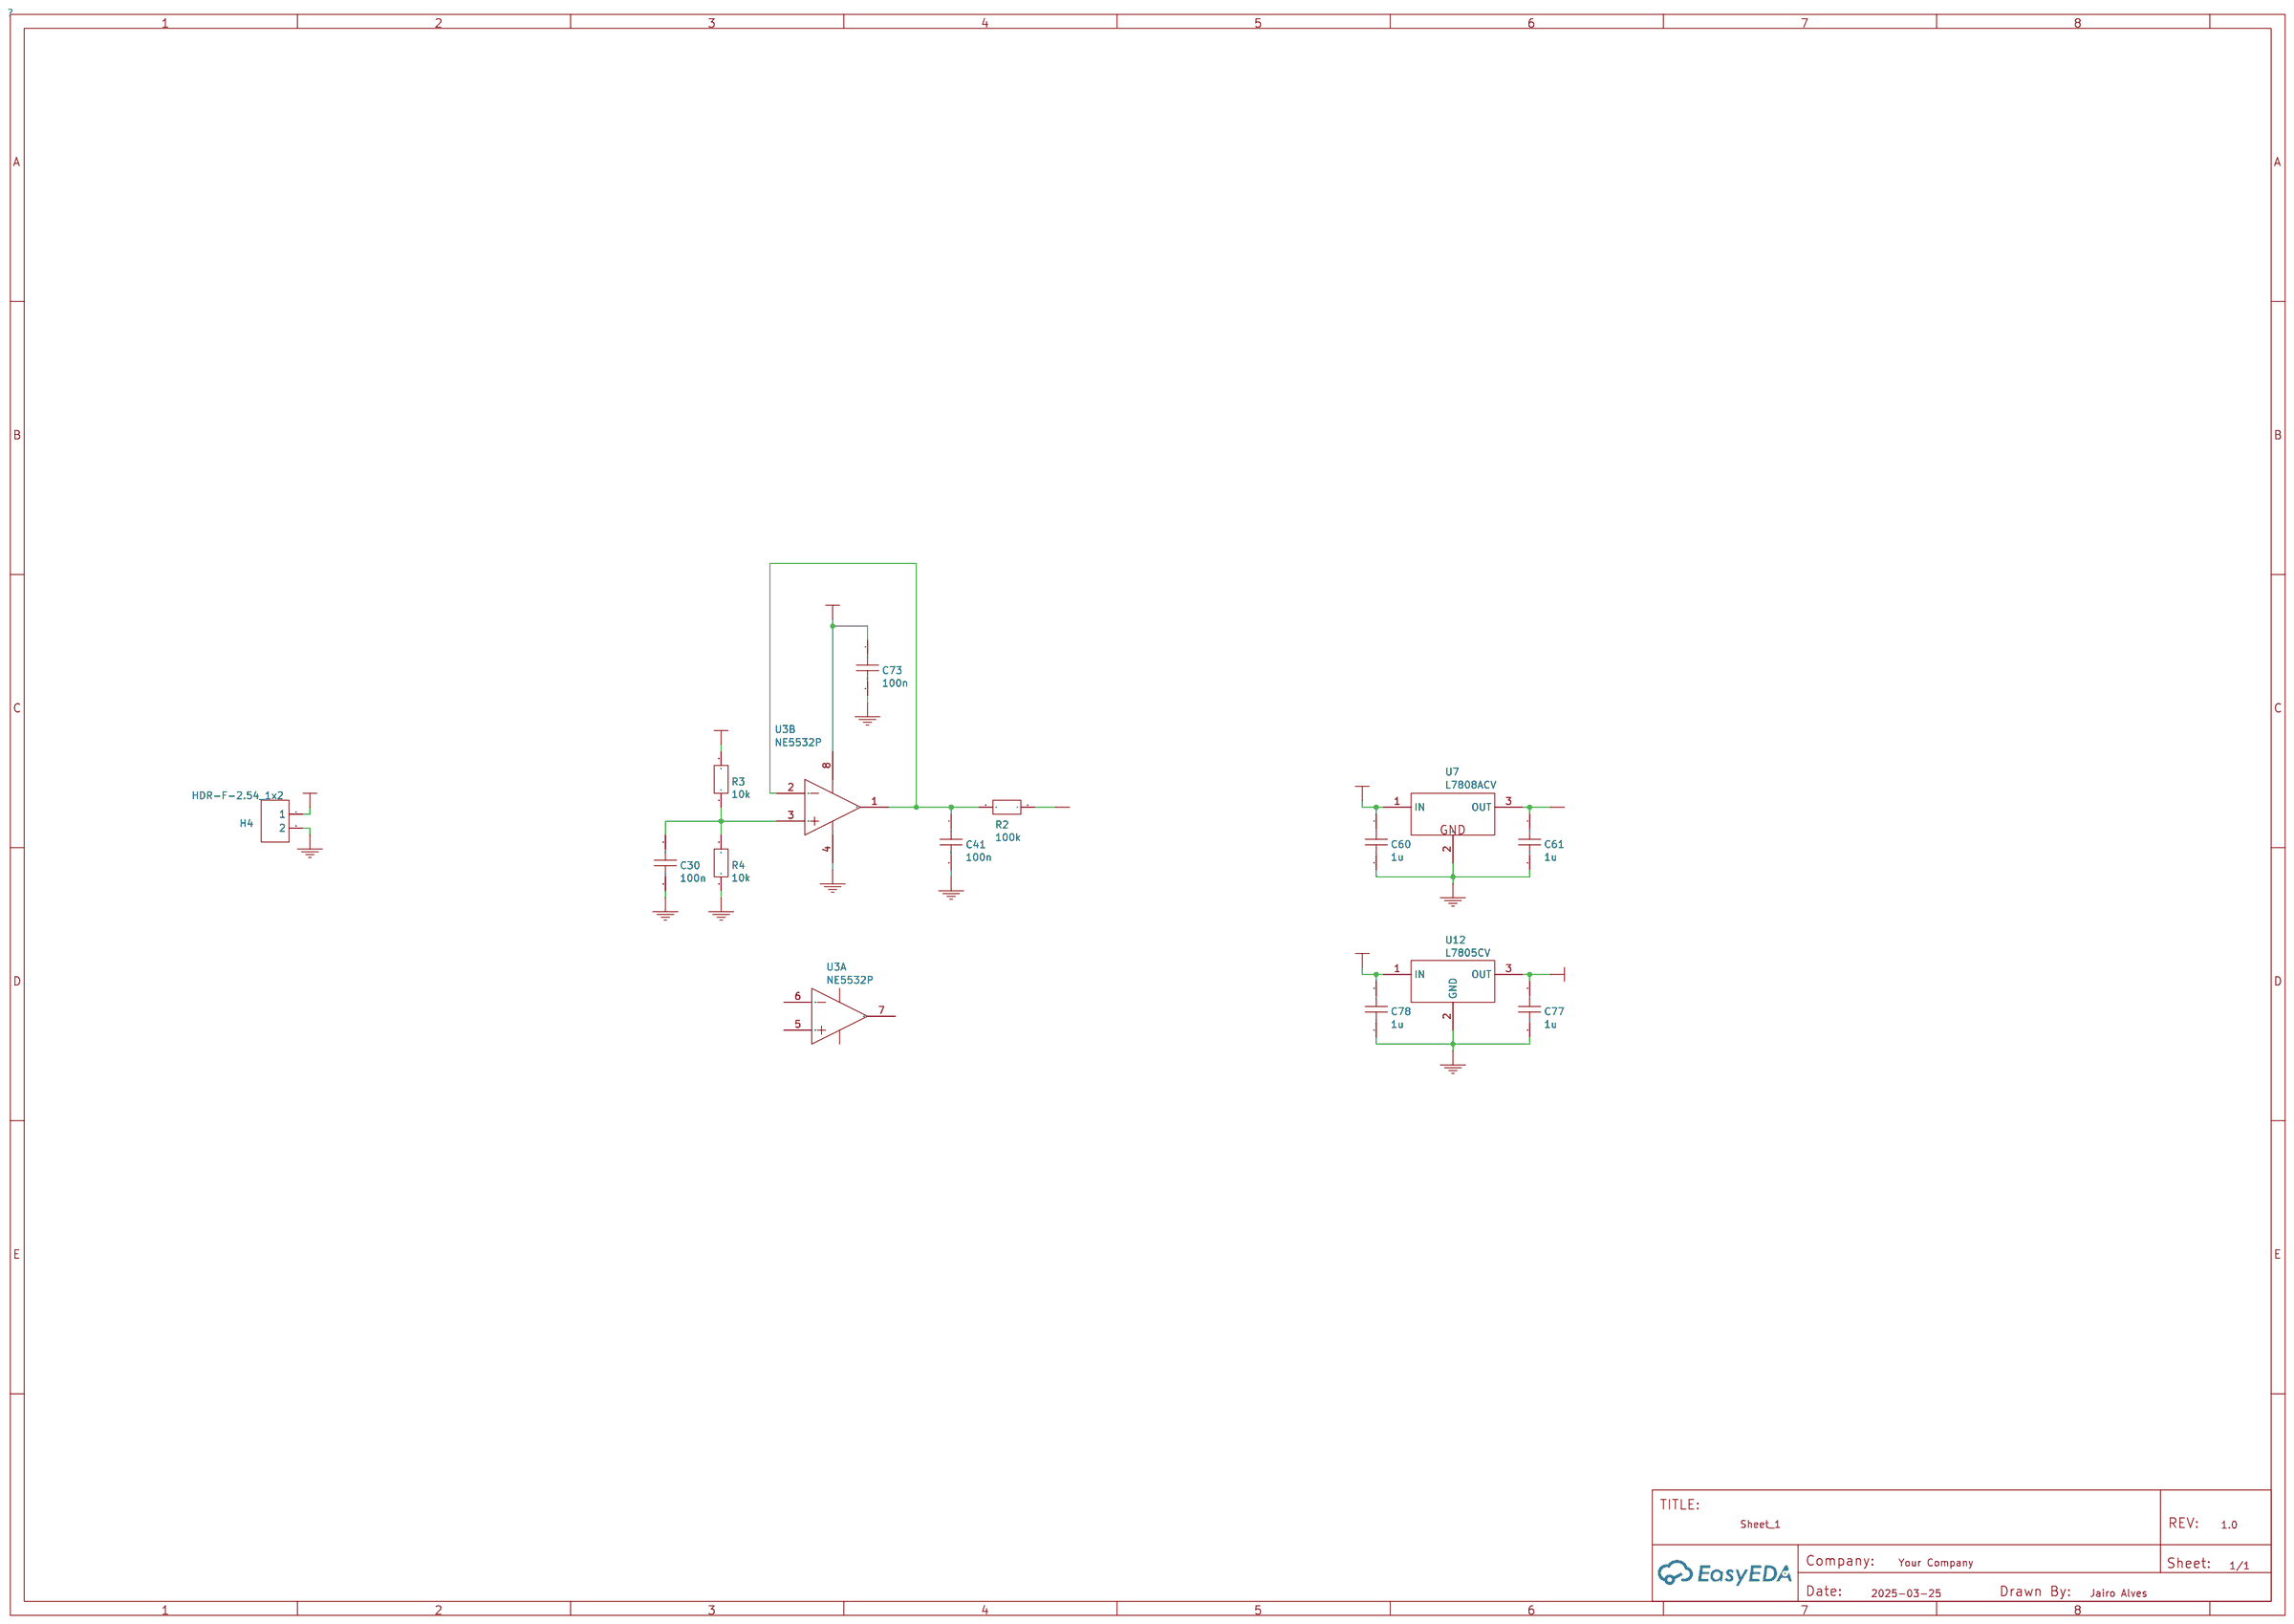
[diagram p4: POWER]
2 DIGITAL
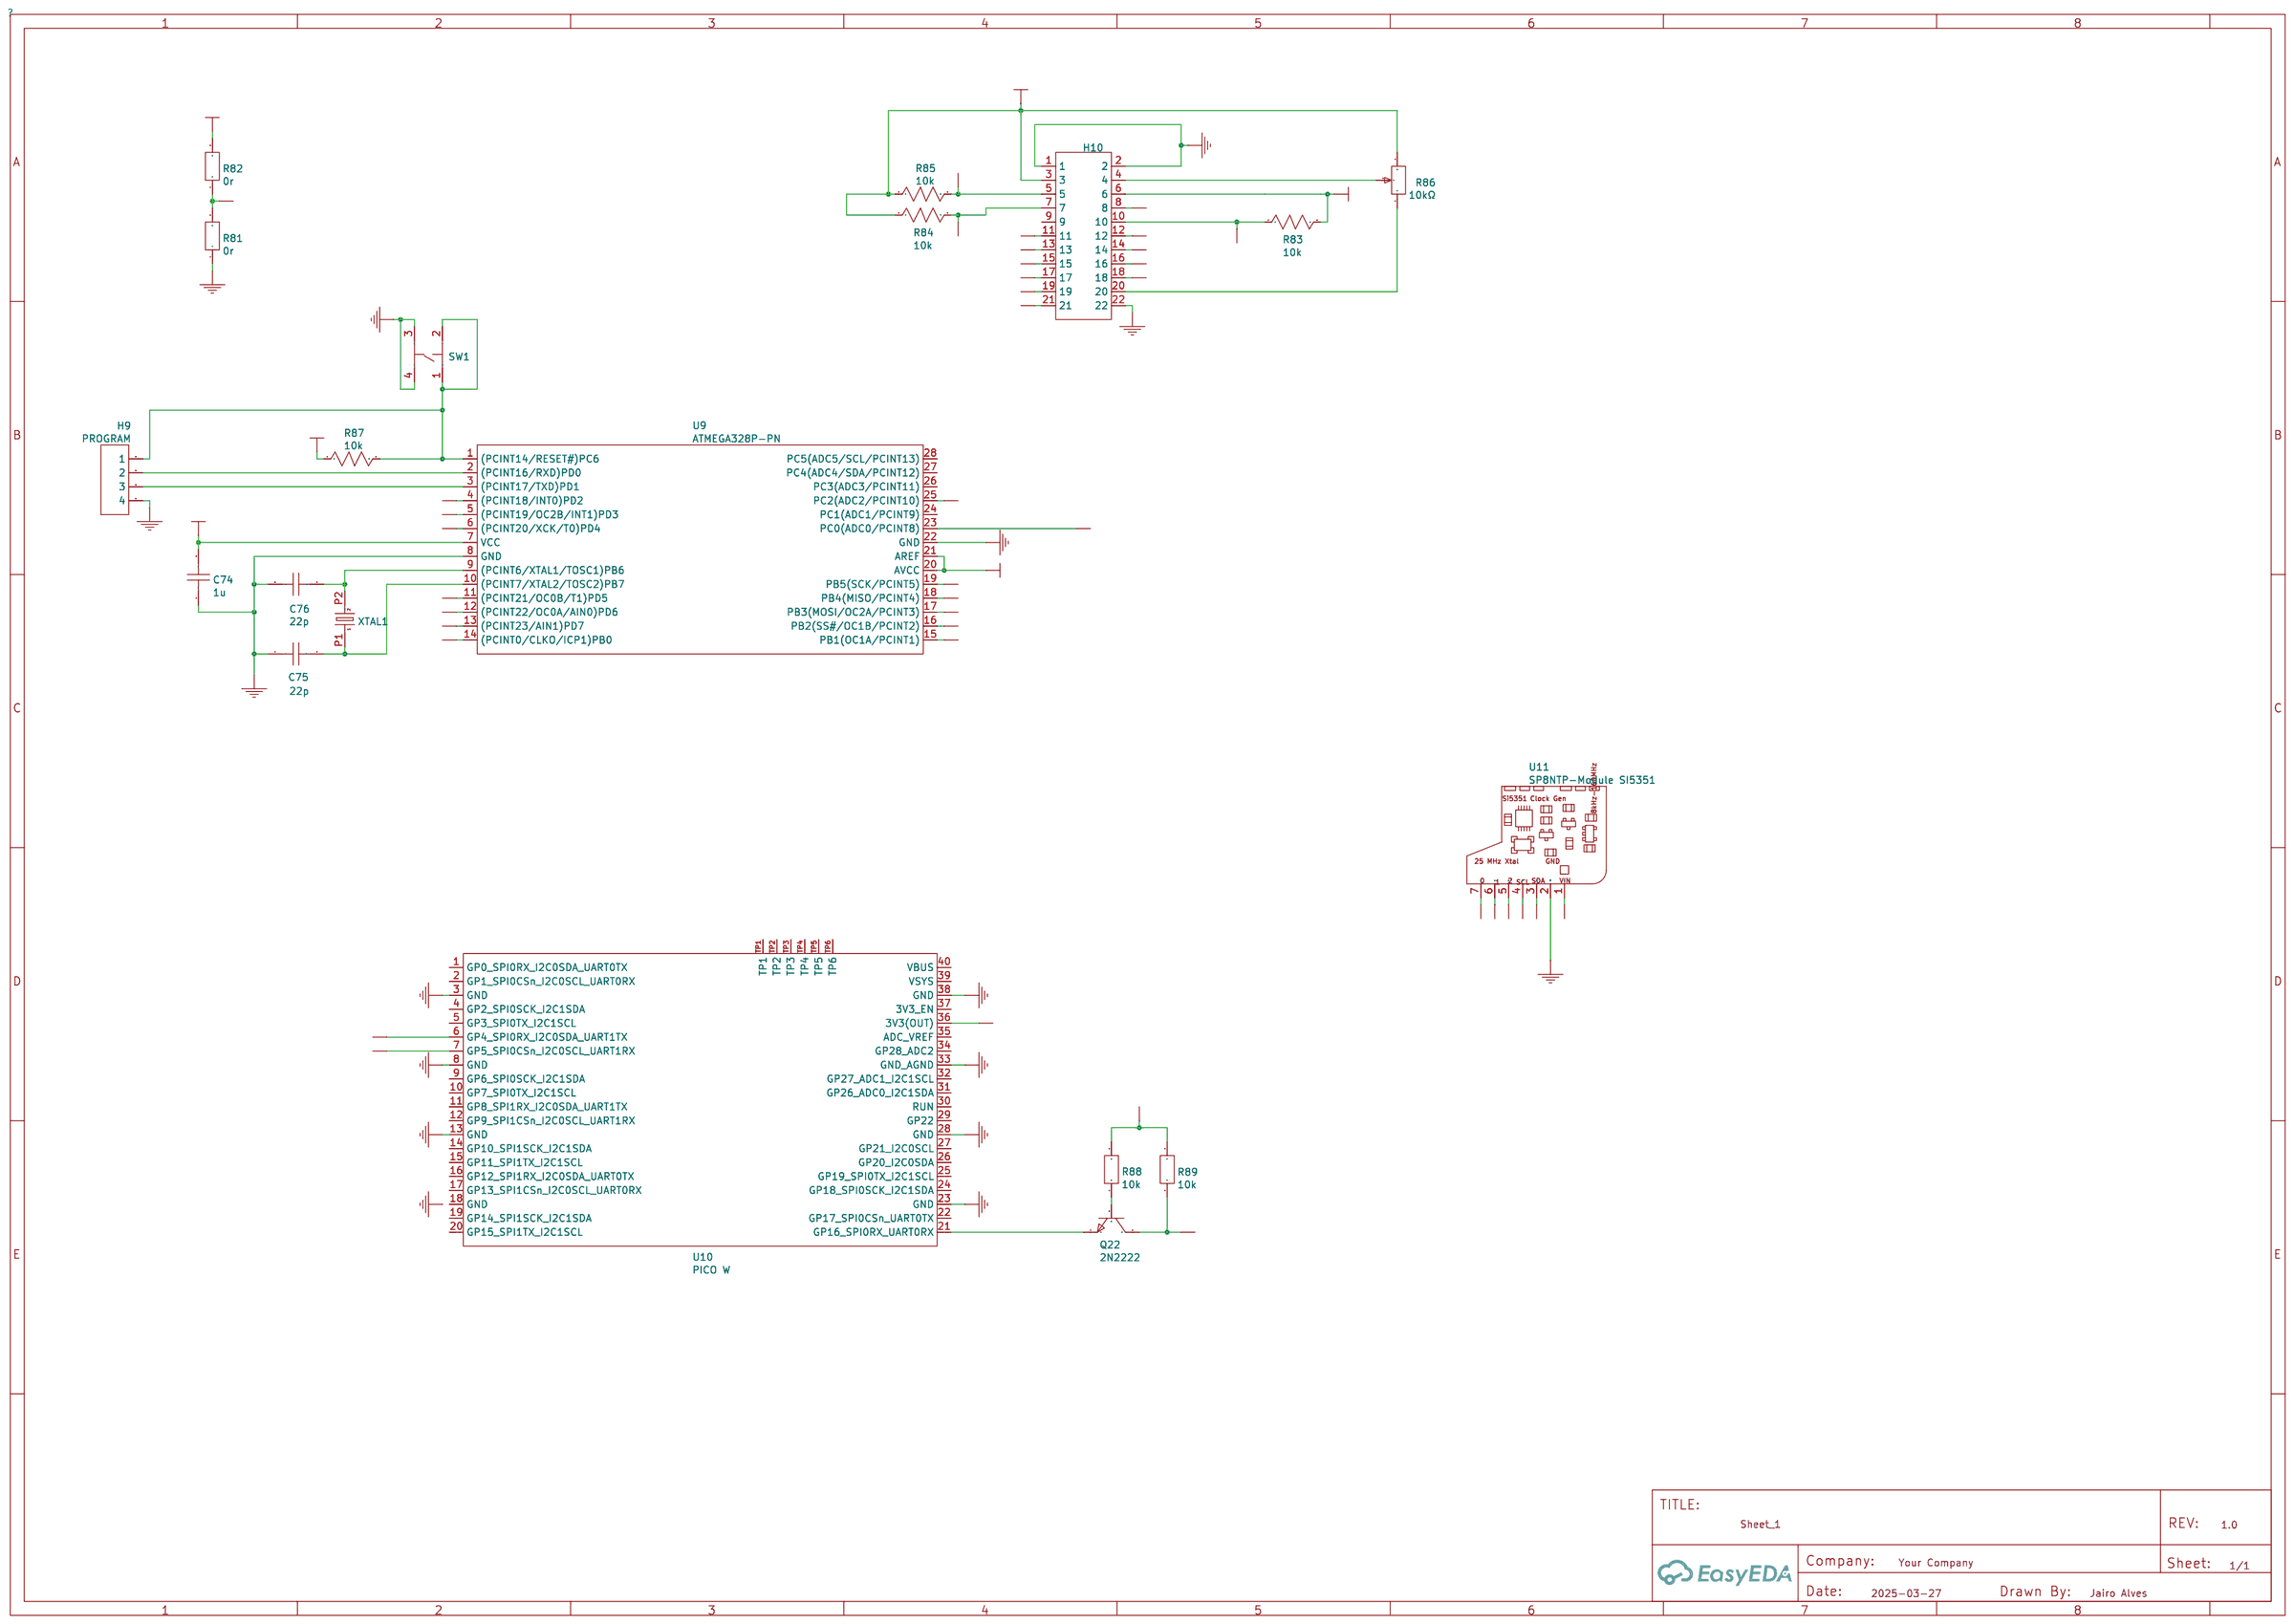
[diagram p5: DIGITAL]

## Parts
sheet DIGITAL
C74  1u  [RAD-0.1]
C75  22p  [RAD-0.1]
C76  22p  [RAD-0.1]
H9  PROGRAM
H10  HC-PZ254-11.5L-2X11PZ
Q22  2N2222
R81  0r
R82  0r
R83  10k  [R_AXIAL-0.3]
R84  10k  [R_AXIAL-0.3]
R85  10k  [R_AXIAL-0.3]
R86  10kΩ
R87  10k  [R_AXIAL-0.3]
R88  10k  [R_AXIAL-0.3]
R89  10k  [R_AXIAL-0.3]
SW1  TL3305AF160QG
U9  ATMEGA328P-PN
U10  PICO W
U11  SP8NTP-Module SI5351
XTAL1  OSC-XTAL-HC-49U-PTH
sheet POWER
C30  100n  [RAD-0.1]
C41  100n  [RAD-0.1]
C60  1u
C61  1u
C73  100n  [RAD-0.1]
C77  1u
C78  1u
H4  HDR-F-2.54_1x2  [HDR-F-2.54_1X2]
R2  100k  [R_AXIAL-0.3]
R3  10k  [R_AXIAL-0.3]
R4  10k  [R_AXIAL-0.3]
U3  NE5532P  [DIP-8_L9.4-W6.4-P2.54-LS9.1-BL]  (sections 1,2)
U7  L7808ACV
U12  L7805CV

## Library data of the parts
C74 = 1u: nameAlias: Value(F); Contributor: LCEDA_Lib; spicePre: C; spiceSymbolName: C_RAD-0.1_US
C75 C76 = 22p: nameAlias: Value(F); Contributor: LCEDA_Lib; spicePre: C; spiceSymbolName: C_RAD-0.1_US
H9 = PROGRAM: Supplier Part: C225501; Supplier: LCSC; Contributor: LCEDA_Lib; spicePre: H; spiceSymbolName: HDR-F-2.54_1x4
H10 = HC-PZ254-11.5L-2X11PZ: Supplier: LCSC; Supplier Part: C41375952; Manufacturer: HC(虹成电子); Manufacturer Part: HC-PZ254-11.5L-2x11PZ; JLCPCB Part Class: Extended Part; Contributor: lcsc; spicePre: H
Q22 = 2N2222: Supplier: LCSC; Manufacturer: ST(先科); Manufacturer Part: 2N2222A; Supplier Part: C118536; JLCPCB Part Class: Extended Part; Contributor: LCSC; spicePre: Q
R81 R82 = 0r: nameAlias: Value(Ω); Contributor: LCEDA_Lib; spicePre: R; spiceSymbolName: R_1206_EU
R83-R85 R87 = 10k: nameAlias: Value(Ω); Contributor: LCEDA_Lib; spicePre: R; spiceSymbolName: R_AXIAL-0.3_US
R86 = 10kΩ: Supplier: LCSC; Supplier Part: C5892179; Manufacturer: BOURNS; Manufacturer Part: 3296W-1-103; JLCPCB Part Class: Extended Part; nameAlias: Value; Contributor: lcsc; spicePre: R; spiceSymbolName: 3296W-1-103_C5892179
R3 R4 R88 R89 = 10k: nameAlias: Value(Ω); Contributor: LCEDA_Lib; spicePre: R; spiceSymbolName: R_AXIAL-0.3_EU
SW1 = TL3305AF160QG: Supplier: LCSC; Supplier Part: C2886899; Manufacturer: E-Switch; JLCPCB Part Class: Extended Part; Contributor: lcsc; spicePre: S
U9 = ATMEGA328P-PN: Supplier: LCSC; Supplier Part: C1337455; Manufacturer: MICROCHIP(美国微芯); JLCPCB Part Class: Extended Part; Contributor: LCSC; spicePre: U
U10 = PICO W: Supplier: LCSC; Supplier Part: C7203003; Manufacturer: Raspberry Pi(树莓派); JLCPCB Part Class: Extended Part; Contributor: lcsc; spicePre: U
U11 = SP8NTP-Module SI5351: Contributor: sp8ntp; spicePre: U
XTAL1 = OSC-XTAL-HC-49U-PTH: Contributor: DangerousPrototype; spicePre: X
C30 C41 C73 = 100n: nameAlias: Value(F); Contributor: LCEDA_Lib; spicePre: C; spiceSymbolName: C_RAD-0.1_US
C60 C61 C77 C78 = 1u: nameAlias: Value(F); Contributor: LCEDA_Lib; spicePre: C; spiceSymbolName: C_RAD-0.3_US
H4 = HDR-F-2.54_1x2: Supplier Part: C49661; Supplier: LCSC; Contributor: LCEDA_Lib; spicePre: H
R2 = 100k: nameAlias: Value(Ω); Contributor: LCEDA_Lib; spicePre: R; spiceSymbolName: R_AXIAL-0.3_EU
U3 = NE5532P: tags: Audio Operational Amplifier; image: http://image.lceda.cn/szlcsc/C5326.jpg; Supplier Part: C5326; Supplier: LCSC; Manufacturer: TI(德州仪器); JLCPCB Part Class: Extended Part; timeStamp: 1460221582; subpart_no: 1; spicePre: U
U7 = L7808ACV: spicePre: U
U12 = L7805CV: Supplier: LCSC; Manufacturer: ST(意法半导体); Supplier Part: C111887; JLCPCB Part Class: Extended Part; spicePre: U

## Nets
3V3: R88.1 R89.1 U10.36(3V3(OUT)) U11.1(UIN)
+5V: C74.2 C77.1 H10.3 H10.6 R82.2 R83.2 R84.1 R85.1 R86.3 R87.1 U9.7(VCC) U9.20(AVCC) U9.21(AREF) U12.3(OUT)
GND: C30.2 C41.2 C60.2 C61.2 C73.2 C74.1 C75.1 C76.1 C77.2 C78.2 H4.2 H9.4 H10.1 H10.2 H10.22 R4.1 R81.1 SW1.3 SW1.4 U3.4(VCC-) U7.2(GND) U9.8(GND) U9.22(GND) U10.3(GND) U10.8(GND) U10.13(GND) U10.23(GND) U10.28(GND) U10.33(GND_AGND) U10.38(GND) U11.2(GND) U12.2(GND)
VCC: C60.1 C73.1 C78.1 H4.1 R3.2 U3.8(VCC+) U7.1(IN) U12.1(IN)
BFO: U11.7(0)
BKL: H10.21 U9.16(PB2(SS#/OC1B/PCINT2))
CW_CARRIER: U11.5(2)
FS: H10.19 R81.2 R82.1
MXRPWR: C61.1 U7.3(OUT)
PB0: H10.17 U9.14((PCINT0/CLKO/ICP1)PB0)
PB1: H10.18 U9.15(PB1(OC1A/PCINT1))
PB3: H10.7 R84.2 U9.17(PB3(MOSI/OC2A/PCINT3))
PB4: H10.8 U9.18(PB4(MISO/PCINT4))
PB5: H10.10 R83.1 U9.19(PB5(SCK/PCINT5))
PC2: H10.5 R85.2 U9.25(PC2(ADC2/PCINT10))
PD2: H10.11 U9.4((PCINT18/INT0)PD2)
PD3: H10.12 U9.5((PCINT19/OC2B/INT1)PD3)
PD4: H10.13 U9.6((PCINT20/XCK/T0)PD4)
PD5: H10.14 U9.11((PCINT21/OC0B/T1)PD5)
PD6: H10.15 U9.12((PCINT22/OC0A/AIN0)PD6)
PD7: H10.16 U9.13((PCINT23/AIN1)PD7)
SCL: U10.7(GP5_SPI0CSn_I2C0SCL_UART1RX) U11.4(SCL)
SCRDAT: Q22.3(C) R89.2 U9.23(PC0(ADC0/PCINT8))
SDA: U10.6(GP4_SPI0RX_I2C0SDA_UART1TX) U11.3(SDA)
VCC/2: R2.1
VFO: U11.6(1)
Net-(C30-1): C30.1 R3.1 R4.2 U3.3(IN1+)
Net-(C41-1): C41.1 R2.2 U3.1(OUT1) U3.2(IN1-)
Net-(C75-2): C75.2 U9.10((PCINT7/XTAL2/TOSC2)PB7) XTAL1.P1(1)
Net-(C76-2): C76.2 U9.9((PCINT6/XTAL1/TOSC1)PB6) XTAL1.P2(2)
Net-(H9-1): H9.1 R87.2 SW1.1 SW1.2 U9.1((PCINT14/RESET#)PC6)
Net-(H9-2): H9.2 U9.2((PCINT16/RXD)PD0)
Net-(H9-3): H9.3 U9.3((PCINT17/TXD)PD1)
Net-(H10-4): H10.4 R86.2
Net-(H10-20): H10.20 R86.1
Net-(Q22-1): Q22.1(E) U10.21(GP16_SPI0RX_UART0RX)
Net-(Q22-2): Q22.2(B) R88.2

Not connected (* = marked no-connect by the designer): H10 9; U3 5(IN2+) 6(IN2-) 7(OUT2); U9 24(PC1(ADC1/PCINT9)) 26(PC3(ADC3/PCINT11)) 27(PC4(ADC4/SDA/PCINT12)) 28(PC5(ADC5/SCL/PCINT13)); U10 1(GP0_SPI0RX_I2C0SDA_UART0TX) 2(GP1_SPI0CSn_I2C0SCL_UART0RX) 4(GP2_SPI0SCK_I2C1SDA) 5(GP3_SPI0TX_I2C1SCL) 9(GP6_SPI0SCK_I2C1SDA) 10(GP7_SPI0TX_I2C1SCL) 11(GP8_SPI1RX_I2C0SDA_UART1TX) 12(GP9_SPI1CSn_I2C0SCL_UART1RX) 14(GP10_SPI1SCK_I2C1SDA) 15(GP11_SPI1TX_I2C1SCL) 16(GP12_SPI1RX_I2C0SDA_UART0TX) 17(GP13_SPI1CSn_I2C0SCL_UART0RX) 18(GND) 19(GP14_SPI1SCK_I2C1SDA) 20(GP15_SPI1TX_I2C1SCL) 22(GP17_SPI0CSn_UART0TX) 24(GP18_SPI0SCK_I2C1SDA) 25(GP19_SPI0TX_I2C1SCL) 26(GP20_I2C0SDA) 27(GP21_I2C0SCL) 29(GP22) 30(RUN) 31(GP26_ADC0_I2C1SDA) 32(GP27_ADC1_I2C1SCL) 34(GP28_ADC2) 35(ADC_VREF) 37(3V3_EN) 39(VSYS) 40(VBUS) TP1 TP2 TP3 TP4 TP5 TP6

# Schematic Schematic3

## Sheets
1 LPF
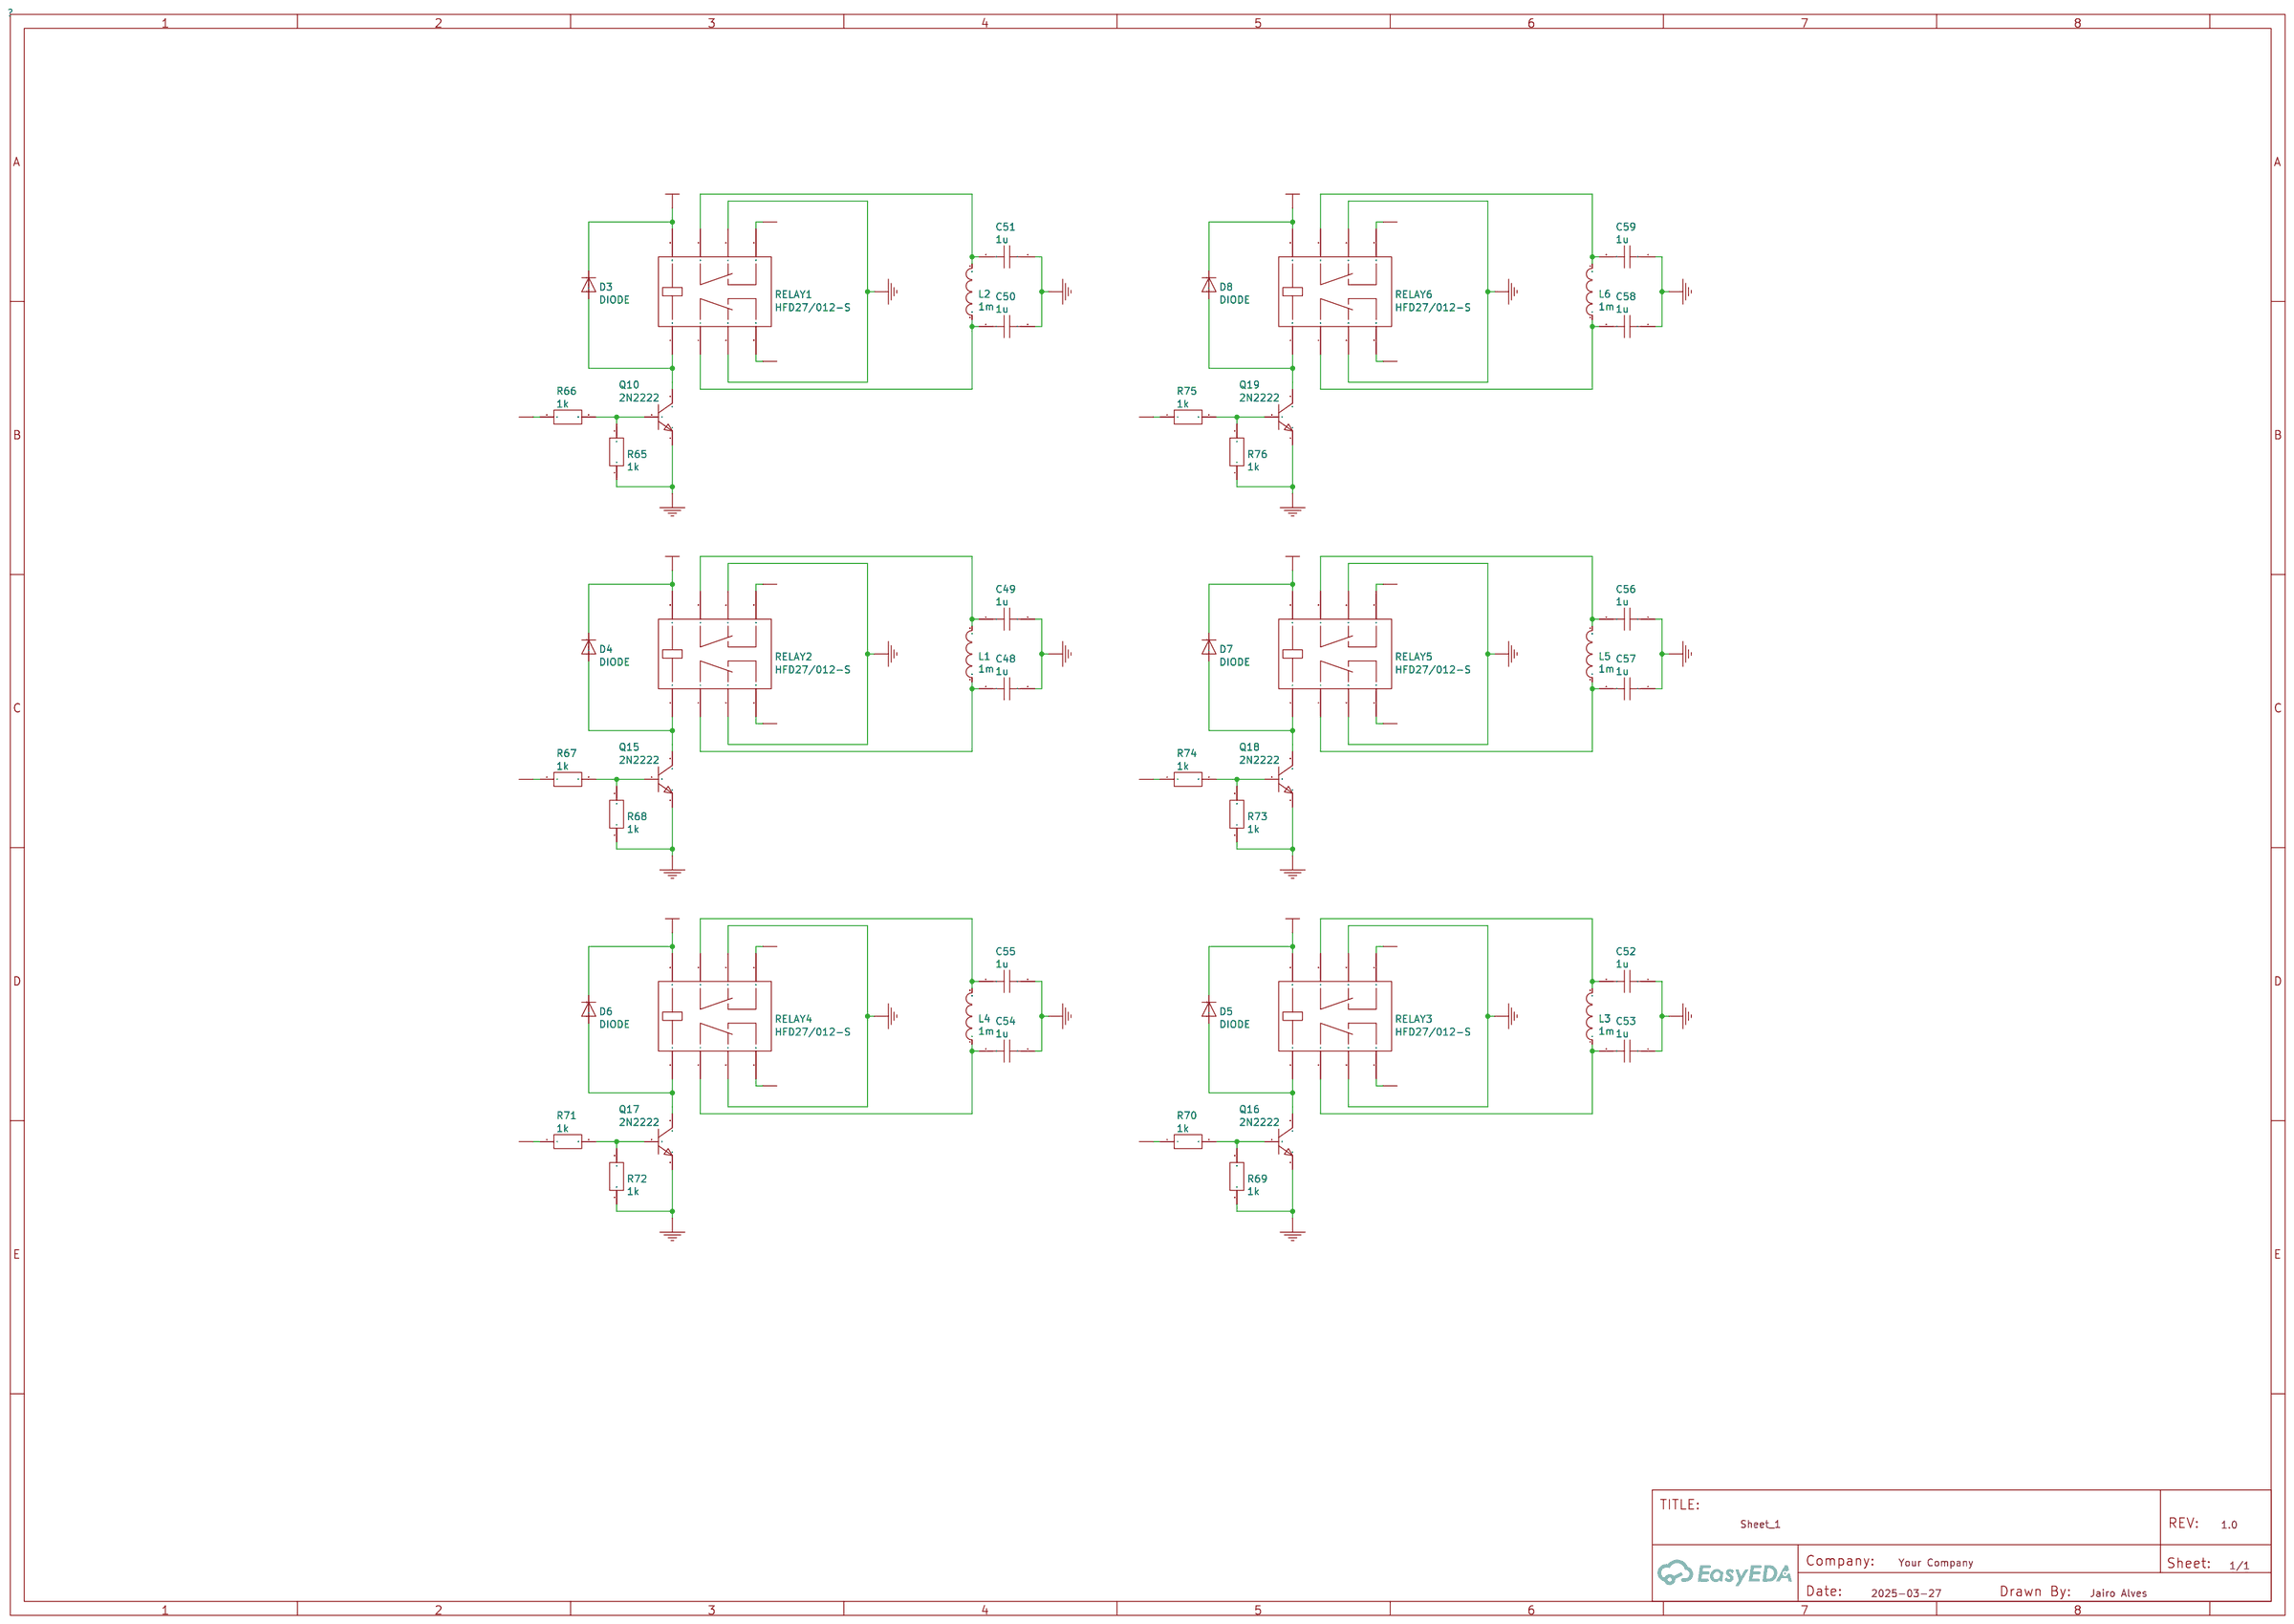
[diagram p6: LPF]
2 TX AMPLIFIER
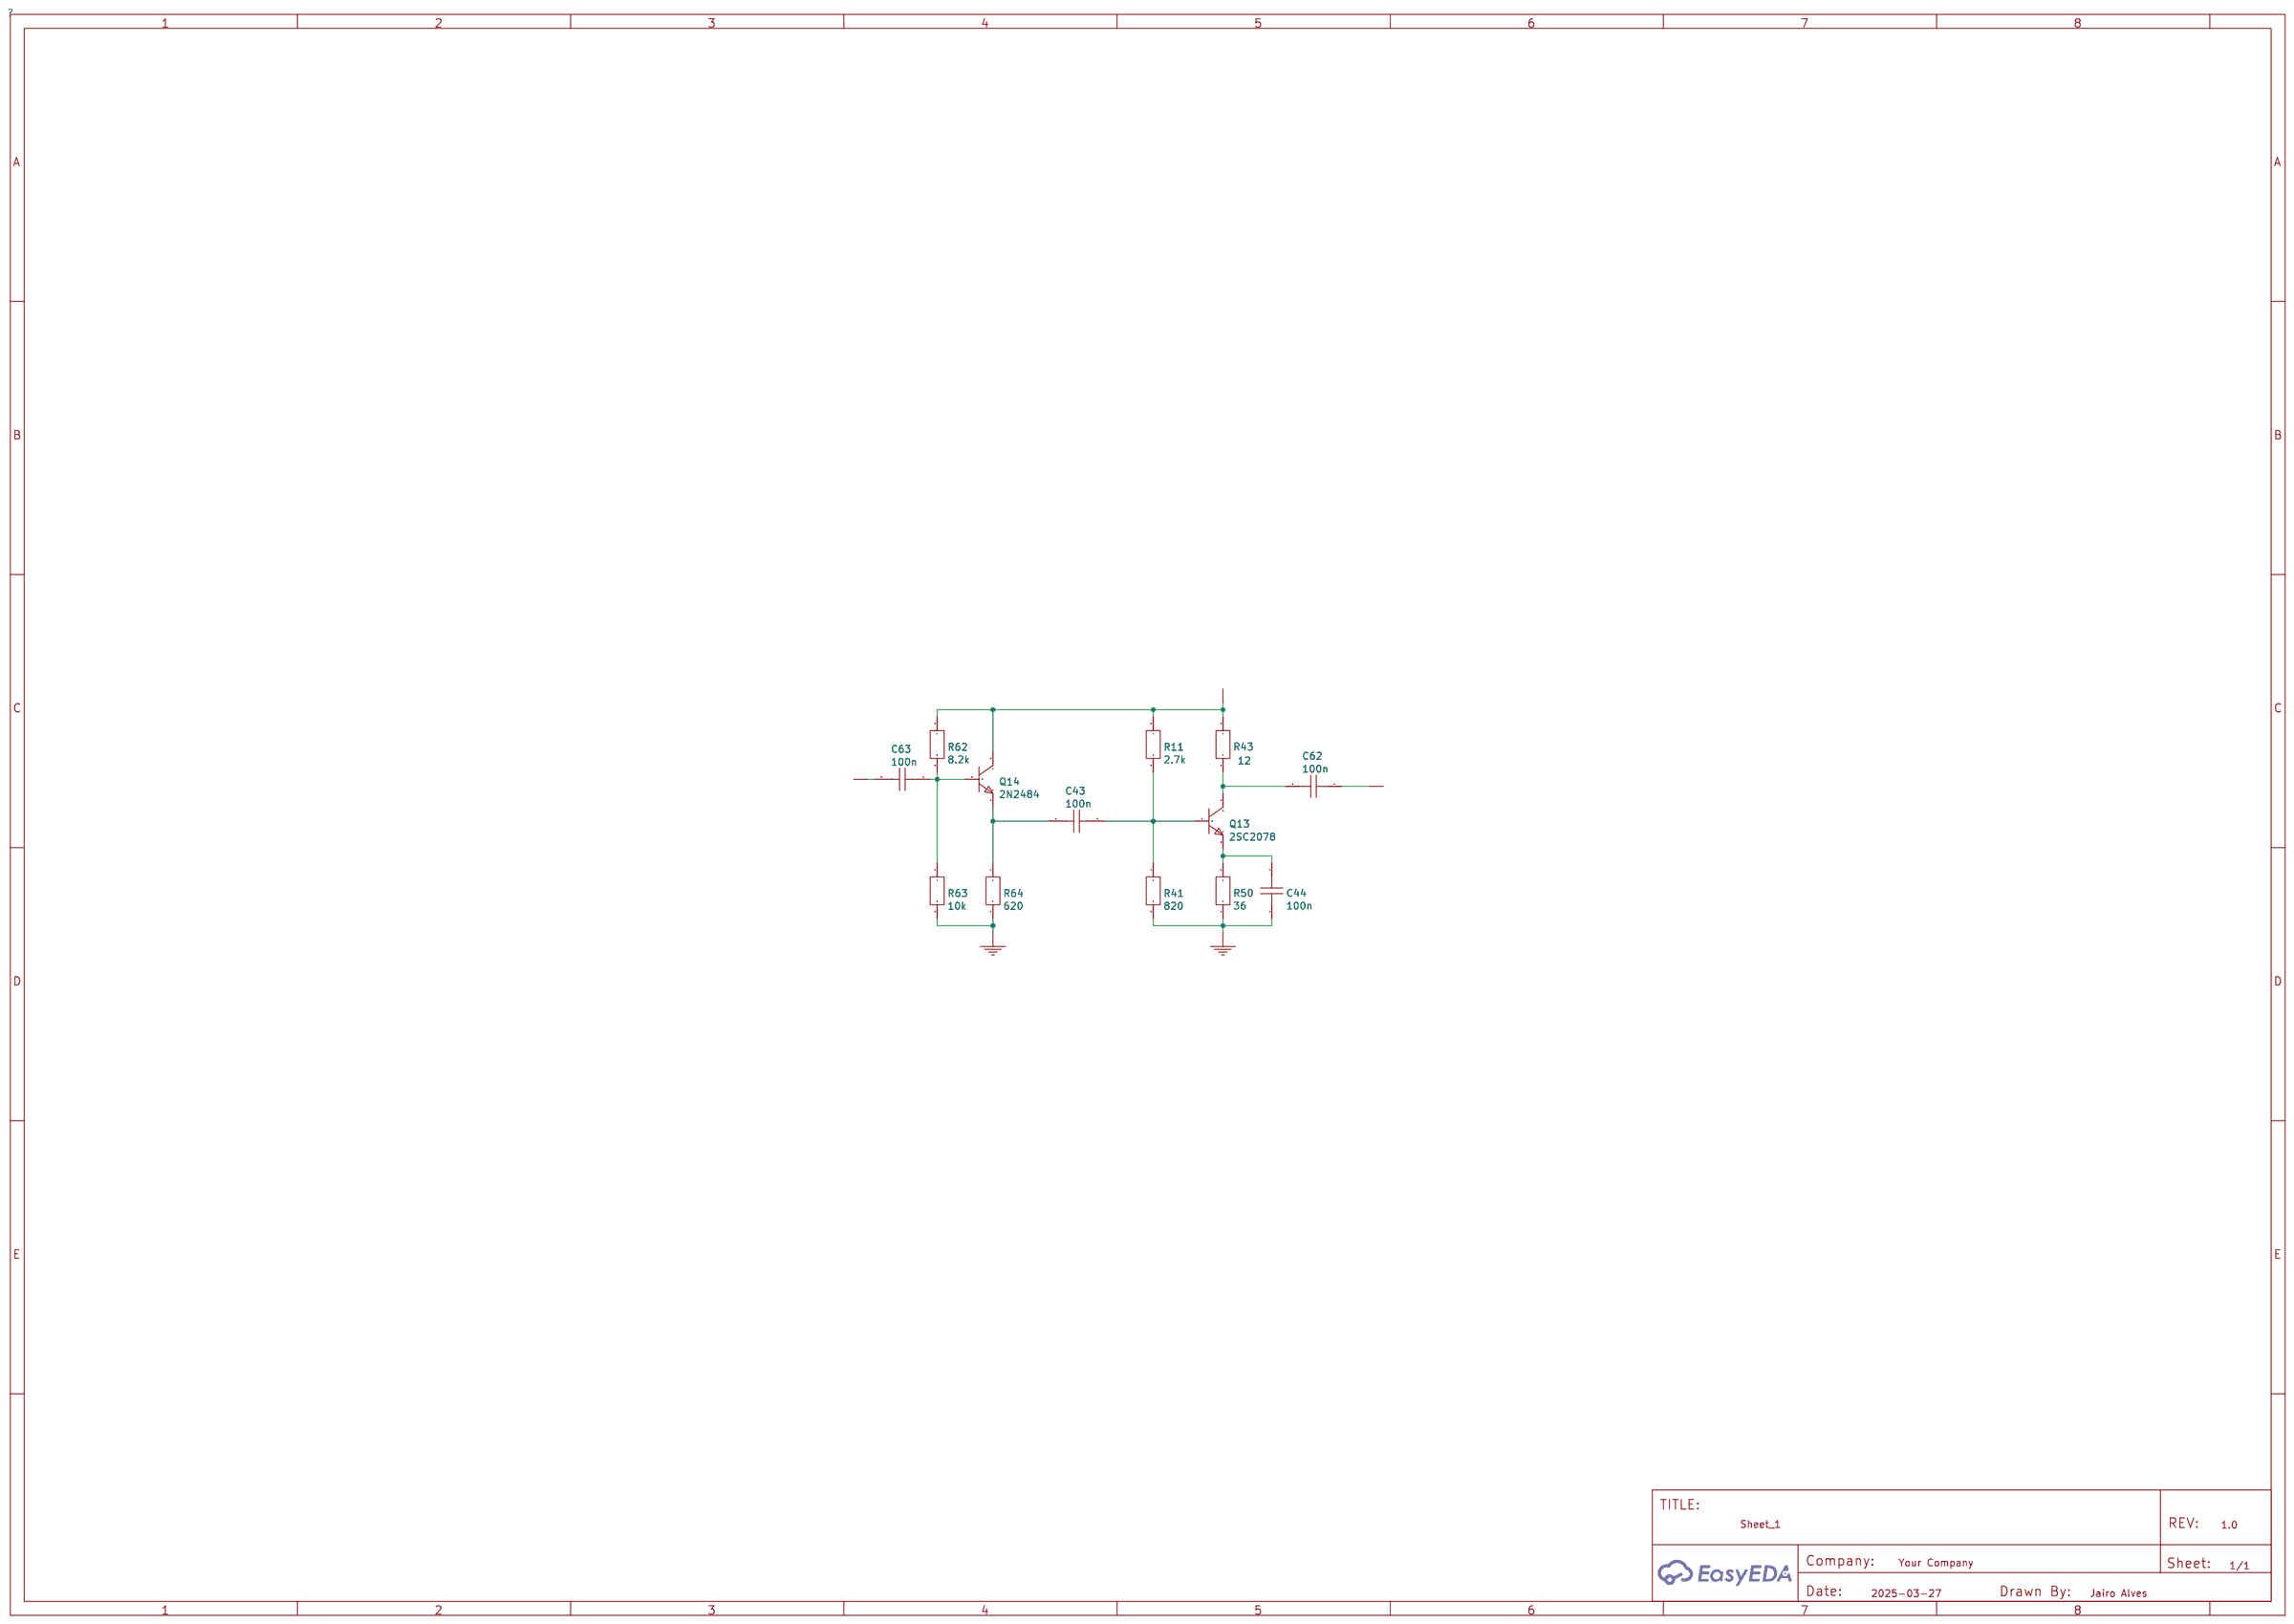
[diagram p7: TX AMPLIFIER]
3 TX_CONTROL
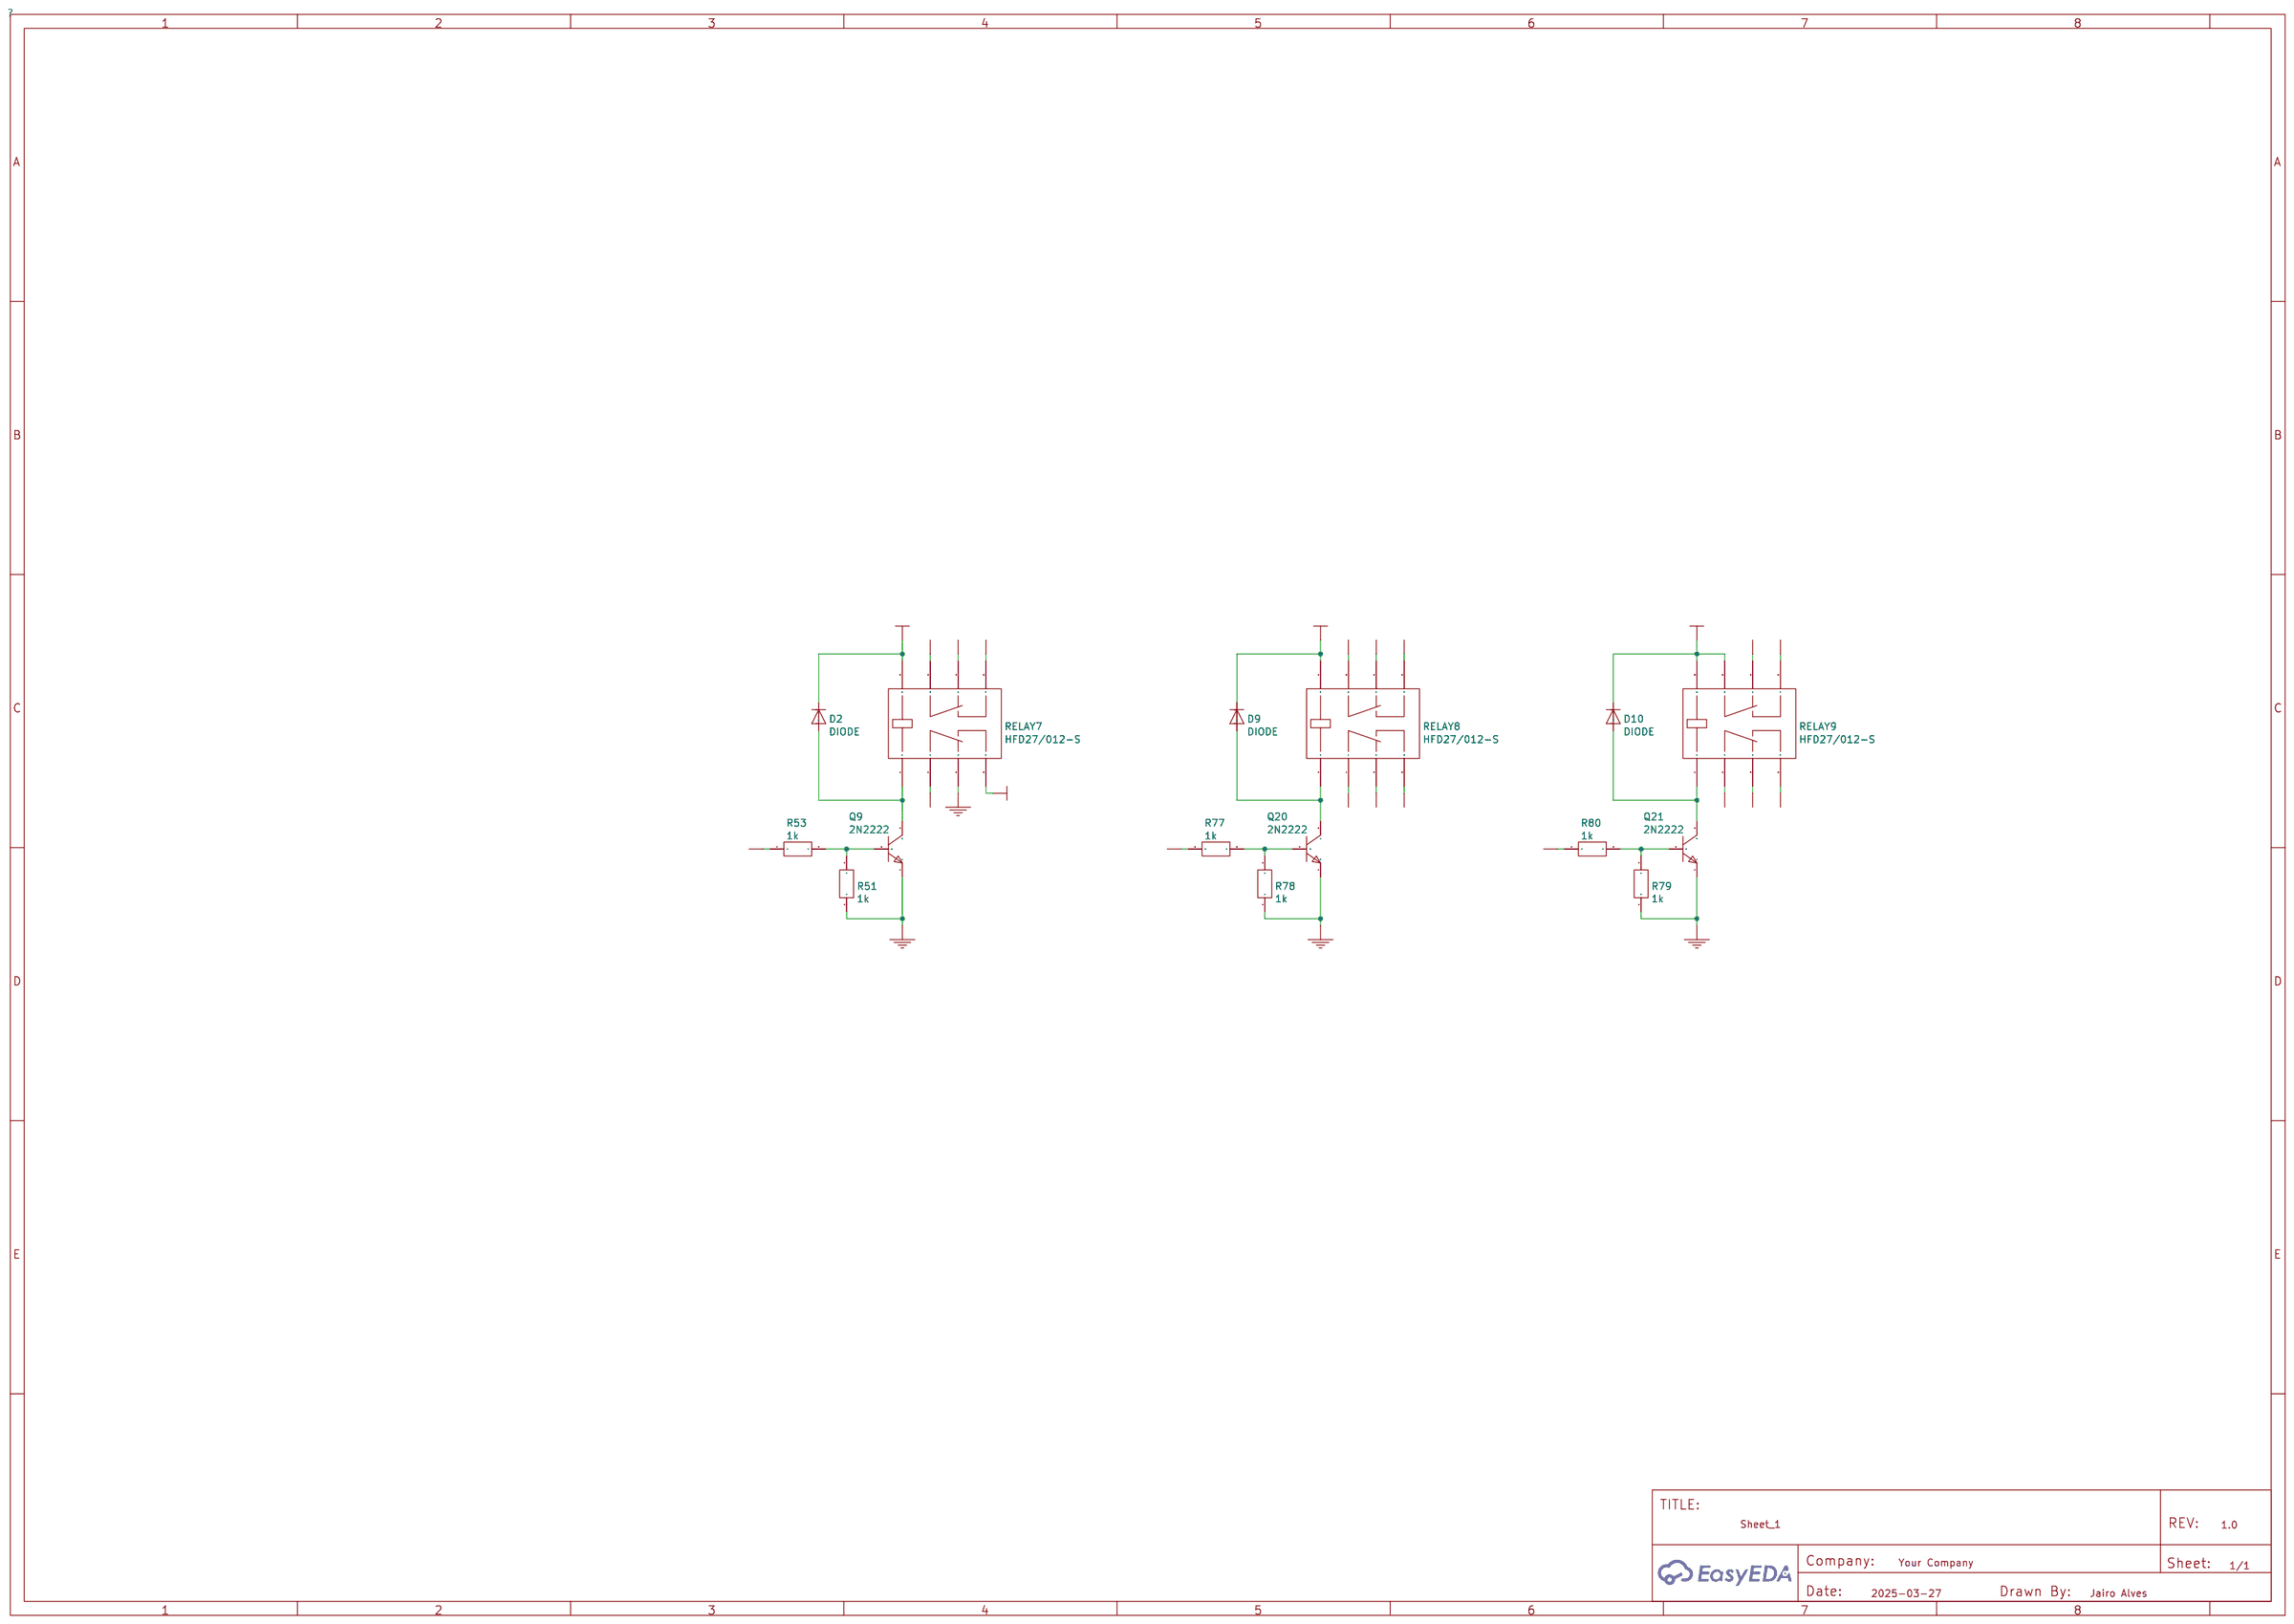
[diagram p8: TX_CONTROL]

## Parts
sheet LPF
C48  1u
C49  1u
C50  1u
C51  1u
C52  1u
C53  1u
C54  1u
C55  1u
C56  1u
C57  1u
C58  1u
C59  1u
D3  DIODE
D4  DIODE
D5  DIODE
D6  DIODE
D7  DIODE
D8  DIODE
L1  1m
L2  1m
L3  1m
L4  1m
L5  1m
L6  1m
Q10  2N2222
Q15  2N2222
Q16  2N2222
Q17  2N2222
Q18  2N2222
Q19  2N2222
R65  1k  [R_AXIAL-0.3]
R66  1k  [R_AXIAL-0.3]
R67  1k  [R_AXIAL-0.3]
R68  1k  [R_AXIAL-0.3]
R69  1k  [R_AXIAL-0.3]
R70  1k  [R_AXIAL-0.3]
R71  1k  [R_AXIAL-0.3]
R72  1k  [R_AXIAL-0.3]
R73  1k  [R_AXIAL-0.3]
R74  1k  [R_AXIAL-0.3]
R75  1k  [R_AXIAL-0.3]
R76  1k  [R_AXIAL-0.3]
RELAY1  HFD27/012-S
RELAY2  HFD27/012-S
RELAY3  HFD27/012-S
RELAY4  HFD27/012-S
RELAY5  HFD27/012-S
RELAY6  HFD27/012-S
sheet TX AMPLIFIER
C43  100n  [RAD-0.1]
C44  100n  [RAD-0.1]
C62  100n  [RAD-0.1]
C63  100n  [RAD-0.1]
Q13  2SC2078
Q14  2N2484
R11  2.7k  [R_AXIAL-0.3]
R41  820  [R_AXIAL-0.3]
R43  12
R50  36
R62  8.2k  [R_AXIAL-0.3]
R63  10k  [R_AXIAL-0.3]
R64  620  [R_AXIAL-0.3]
sheet TX_CONTROL
D2  DIODE
D9  DIODE
D10  DIODE
Q9  2N2222
Q20  2N2222
Q21  2N2222
R51  1k  [R_AXIAL-0.3]
R53  1k  [R_AXIAL-0.3]
R77  1k  [R_AXIAL-0.3]
R78  1k  [R_AXIAL-0.3]
R79  1k  [R_AXIAL-0.3]
R80  1k  [R_AXIAL-0.3]
RELAY7  HFD27/012-S
RELAY8  HFD27/012-S
RELAY9  HFD27/012-S

## Library data of the parts
C48-C59 = 1u: nameAlias: Value(F); Contributor: LCEDA_Lib; spicePre: C; spiceSymbolName: C_RAD-0.3_US
D2-D10 = DIODE: Contributor: Adafruit; spicePre: D
L1-L6 = 1m: nameAlias: Value(H); Contributor: LCEDA_Lib; spicePre: L; spiceSymbolName: L_AXIAL-0.6_US
Q9 Q10 Q15-Q21 = 2N2222: Supplier: LCSC; Manufacturer: ST(先科); Manufacturer Part: 2N2222A; Supplier Part: C118536; JLCPCB Part Class: Extended Part; Contributor: LCSC; spicePre: Q
R51 R53 R65-R80 = 1k: nameAlias: Value(Ω); Contributor: LCEDA_Lib; spicePre: R; spiceSymbolName: R_AXIAL-0.3_EU
RELAY1-RELAY9 = HFD27/012-S: Supplier: LCSC; Manufacturer: HF(宏发); Supplier Part: C13466; JLCPCB Part Class: Extended Part; spicePre: R
C43 C44 C62 C63 = 100n: nameAlias: Value(F); Contributor: LCEDA_Lib; spicePre: C; spiceSymbolName: C_RAD-0.1_US
Q13 = 2SC2078: Supplier: LCSC; Supplier Part: C556180; Manufacturer: Slkor(萨科微); JLCPCB Part Class: Extended Part; Contributor: LCSC; spicePre: Q
Q14 = 2N2484: Supplier: LCSC; Supplier Part: C5444770; Manufacturer: MICROCHIP(美国微芯); Contributor: lcsc; spicePre: Q
R11 = 2.7k: nameAlias: Value(Ω); Contributor: LCEDA_Lib; spicePre: R; spiceSymbolName: R_AXIAL-0.3_EU
R41 = 820: nameAlias: Value(Ω); Contributor: LCEDA_Lib; spicePre: R; spiceSymbolName: R_AXIAL-0.3_EU
R43 = 12: nameAlias: Value(Ω); Contributor: LCEDA_Lib; spicePre: R; spiceSymbolName: R_AXIAL-0.8_EU
R50 = 36: nameAlias: Value(Ω); Contributor: LCEDA_Lib; spicePre: R; spiceSymbolName: R_AXIAL-0.8_EU
R62 = 8.2k: nameAlias: Value(Ω); Contributor: LCEDA_Lib; spicePre: R; spiceSymbolName: R_AXIAL-0.3_EU
R63 = 10k: nameAlias: Value(Ω); Contributor: LCEDA_Lib; spicePre: R; spiceSymbolName: R_AXIAL-0.3_EU
R64 = 620: nameAlias: Value(Ω); Contributor: LCEDA_Lib; spicePre: R; spiceSymbolName: R_AXIAL-0.3_EU

## Nets
GND: C44.2 C48.1 C49.1 C50.1 C51.1 C52.1 C53.1 C54.1 C55.1 C56.1 C57.1 C58.1 C59.1 Q9.1(E) Q10.1(E) Q15.1(E) Q16.1(E) Q17.1(E) Q18.1(E) Q19.1(E) Q20.1(E) Q21.1(E) R41.2 R50.1 R51.1 R63.2 R64.2 R65.1 R68.1 R69.1 R72.1 R73.1 R76.1 R78.1 R79.1 RELAY1.6 RELAY1.11 RELAY2.6 RELAY2.11 RELAY3.6 RELAY3.11 RELAY4.6 RELAY4.11 RELAY5.6 RELAY5.11 RELAY6.6 RELAY6.11 RELAY7.6
VCC: D2.C D3.C D4.C D5.C D6.C D7.C D8.C D9.C D10.C RELAY1.16 RELAY2.16 RELAY3.16 RELAY4.16 RELAY5.16 RELAY6.16 RELAY7.8 RELAY7.16 RELAY8.16 RELAY9.13 RELAY9.16
ANT: RELAY1.9 RELAY2.9 RELAY3.9 RELAY4.9 RELAY5.9 RELAY6.9
B1: R66.1
B2: R67.1
B3: R71.1
B4: R75.1
B5: R74.1
B6: R70.1
CW_IN: RELAY8.9
CW_OUT: RELAY8.8
CWMXR: RELAY9.8
CWPWR: RELAY9.9
LPF_OUT: RELAY1.8 RELAY2.8 RELAY3.8 RELAY4.8 RELAY5.8 RELAY6.8 RELAY7.13
MODE: R77.1 R80.1
MXRPWR: RELAY9.4
PA_OUT: C62.1 RELAY7.9
PREAMP: C63.2 RELAY8.4
RX_IN: RELAY7.11 RELAY8.13
SSB_IN: RELAY8.11
SSB_OUT: RELAY8.6
SSBMXR: RELAY9.6
SSBPWR: RELAY9.11
TX: R53.1
TXP: Q14.3(C) R11.1 R43.2 R62.1 RELAY7.4
Net-(C43-1): C43.1 Q13.1(B) R11.2 R41.1
Net-(C43-2): C43.2 Q14.1(E) R64.1
Net-(C44-1): C44.1 Q13.3(E) R50.2
Net-(C48-2): C48.2 L1.1 RELAY2.4
Net-(C49-2): C49.2 L1.2 RELAY2.13
Net-(C50-2): C50.2 L2.1 RELAY1.4
Net-(C51-2): C51.2 L2.2 RELAY1.13
Net-(C52-2): C52.2 L3.2 RELAY3.13
Net-(C53-2): C53.2 L3.1 RELAY3.4
Net-(C54-2): C54.2 L4.1 RELAY4.4
Net-(C55-2): C55.2 L4.2 RELAY4.13
Net-(C56-2): C56.2 L5.2 RELAY5.13
Net-(C57-2): C57.2 L5.1 RELAY5.4
Net-(C58-2): C58.2 L6.1 RELAY6.4
Net-(C59-2): C59.2 L6.2 RELAY6.13
Net-(C62-2): C62.2 Q13.2(C) R43.1
Net-(C63-1): C63.1 Q14.2(B) R62.2 R63.1
Net-(D2-A): D2.A Q9.3(C) RELAY7.1
Net-(D3-A): D3.A Q10.3(C) RELAY1.1
Net-(D4-A): D4.A Q15.3(C) RELAY2.1
Net-(D5-A): D5.A Q16.3(C) RELAY3.1
Net-(D6-A): D6.A Q17.3(C) RELAY4.1
Net-(D7-A): D7.A Q18.3(C) RELAY5.1
Net-(D8-A): D8.A Q19.3(C) RELAY6.1
Net-(D9-A): D9.A Q20.3(C) RELAY8.1
Net-(D10-A): D10.A Q21.3(C) RELAY9.1
Net-(Q9-2): Q9.2(B) R51.2 R53.2
Net-(Q10-2): Q10.2(B) R65.2 R66.2
Net-(Q15-2): Q15.2(B) R67.2 R68.2
Net-(Q16-2): Q16.2(B) R69.2 R70.2
Net-(Q17-2): Q17.2(B) R71.2 R72.2
Net-(Q18-2): Q18.2(B) R73.2 R74.2
Net-(Q19-2): Q19.2(B) R75.2 R76.2
Net-(Q20-2): Q20.2(B) R77.2 R78.2
Net-(Q21-2): Q21.2(B) R79.2 R80.2
